# EasyEDA Pro project 四合一.epro, schematic Schematic2

## Sheets
1 1口驱动: Create Date: 2024-09-14; Page Name: 1口驱动; Project Name: CH32无刷电调; Schematic Name: Schematic2; Update Date: 2024-09-22; Company: 嘉立创EDA; Page Size: A4; Version: V1.0
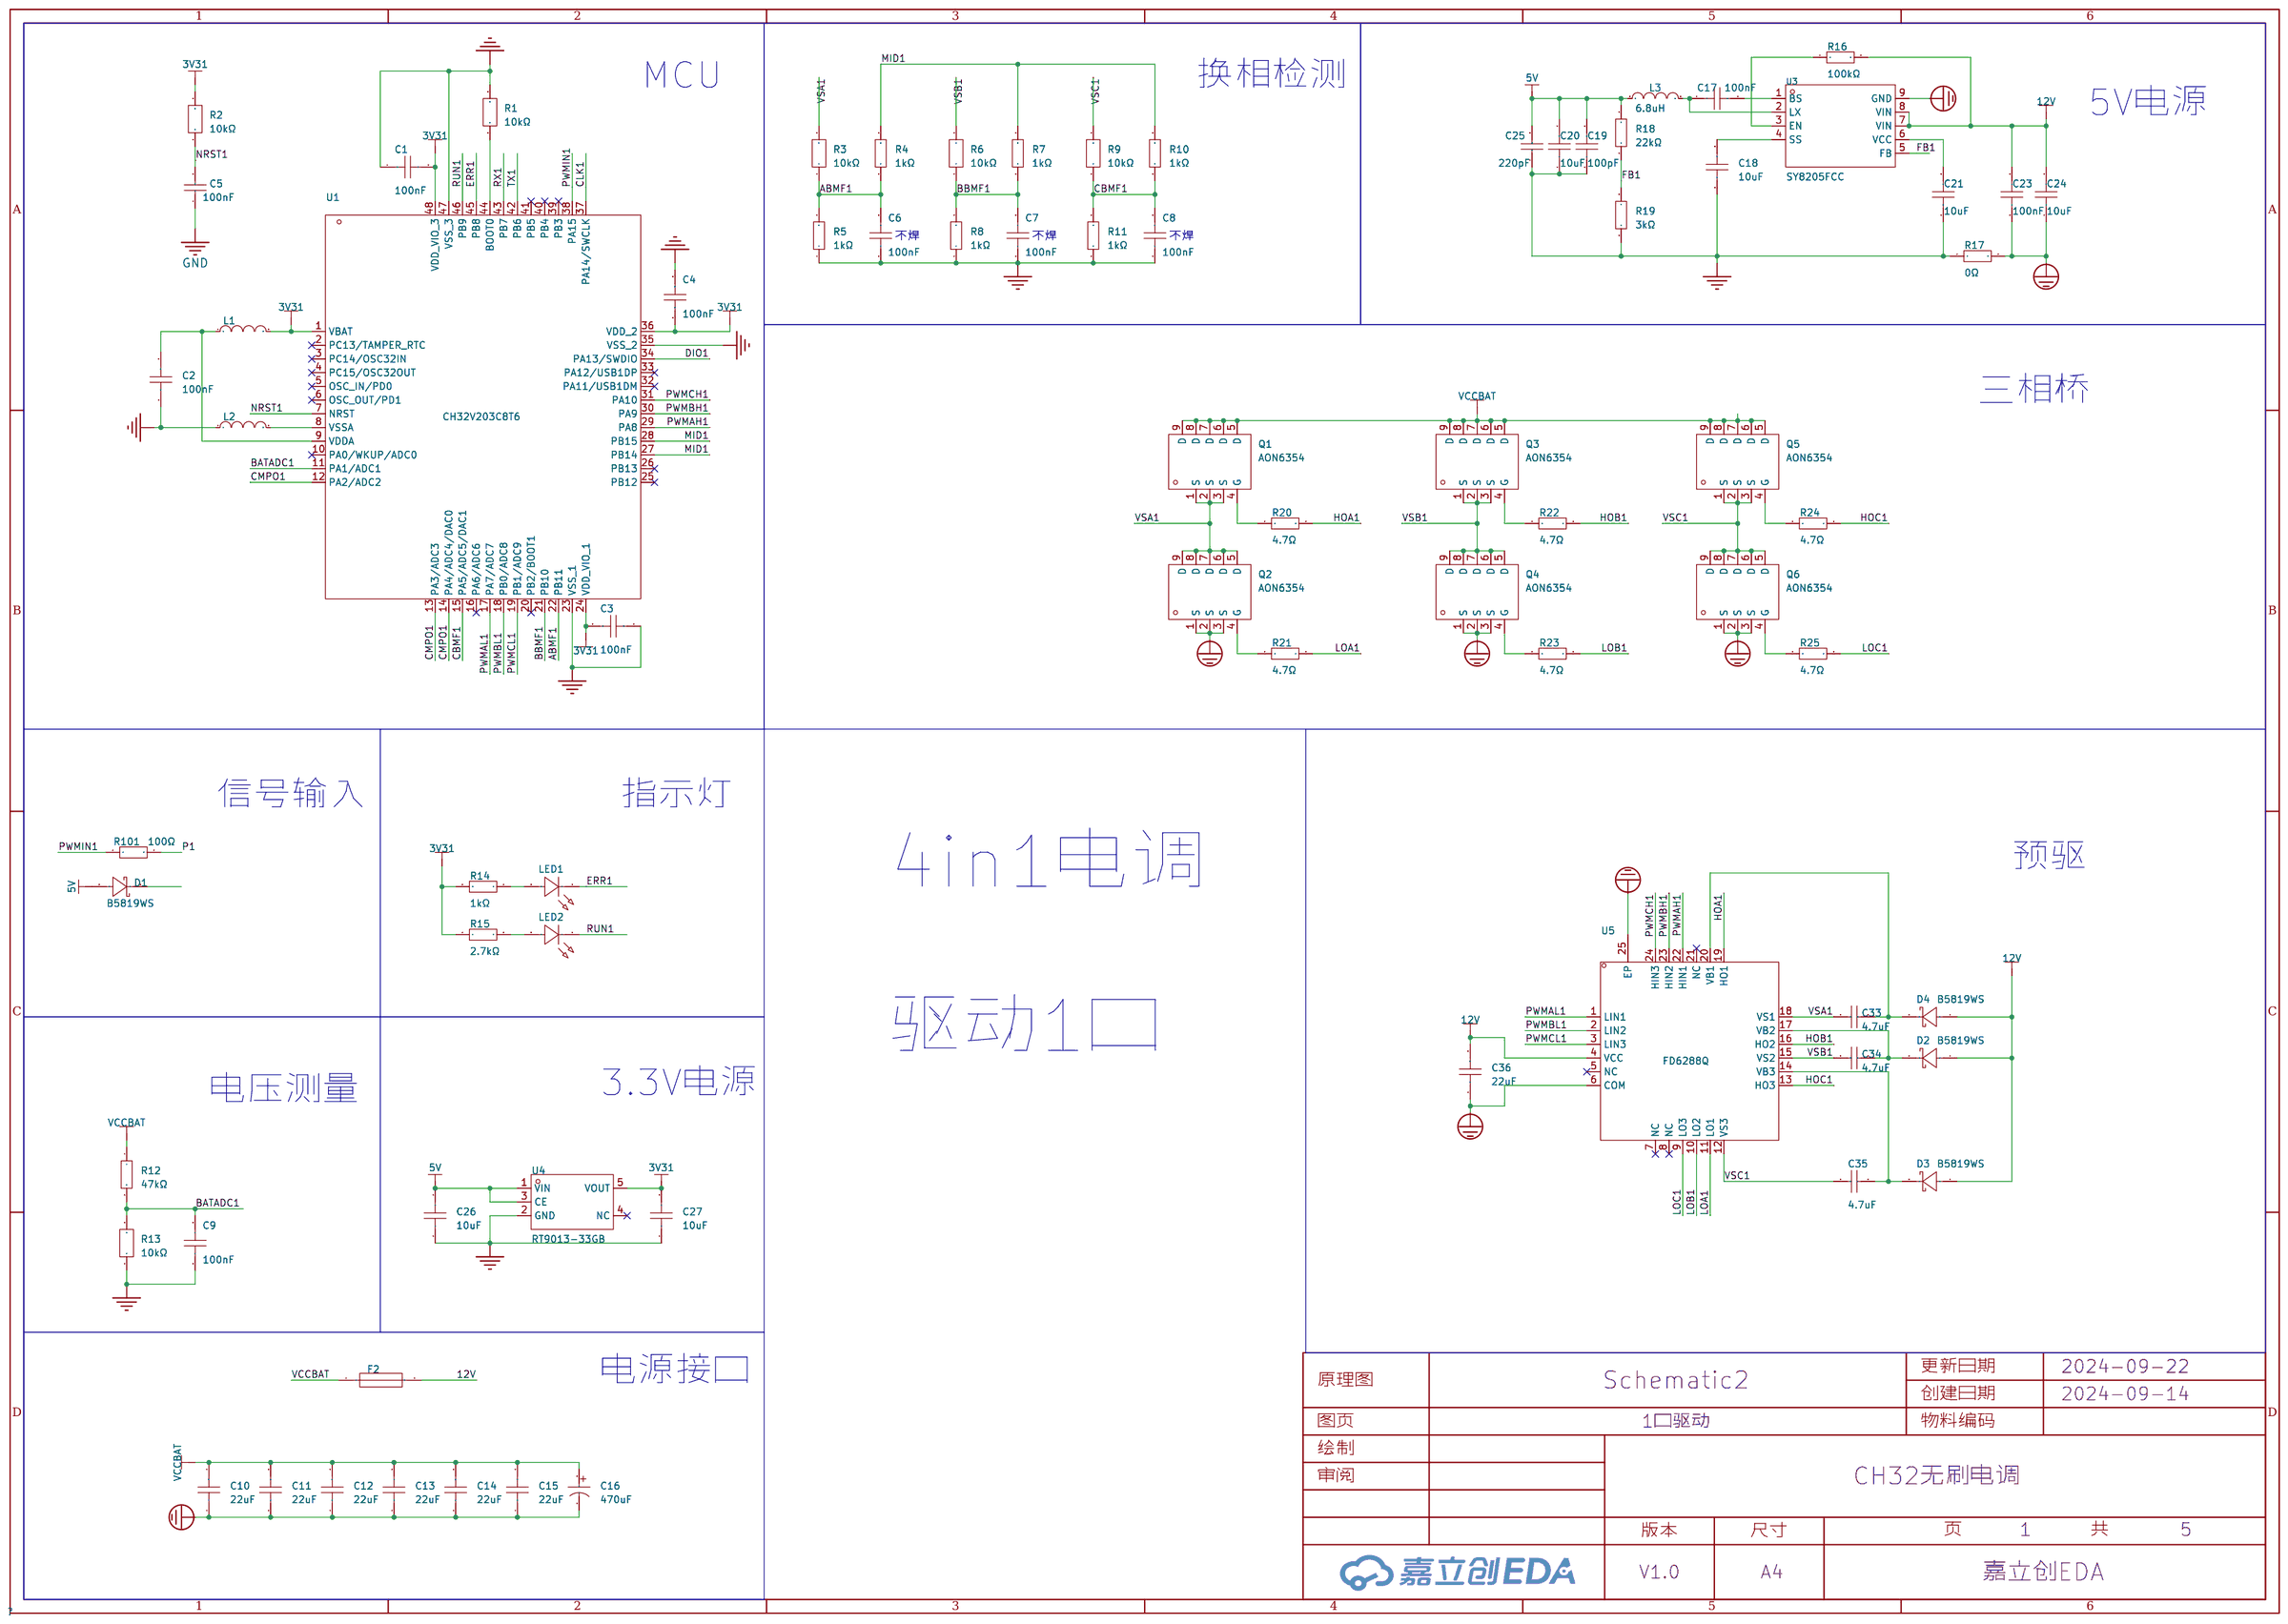
[diagram p0: 1口驱动]
2 2口驱动: Create Date: 2024-09-16; Page Name: 2口驱动
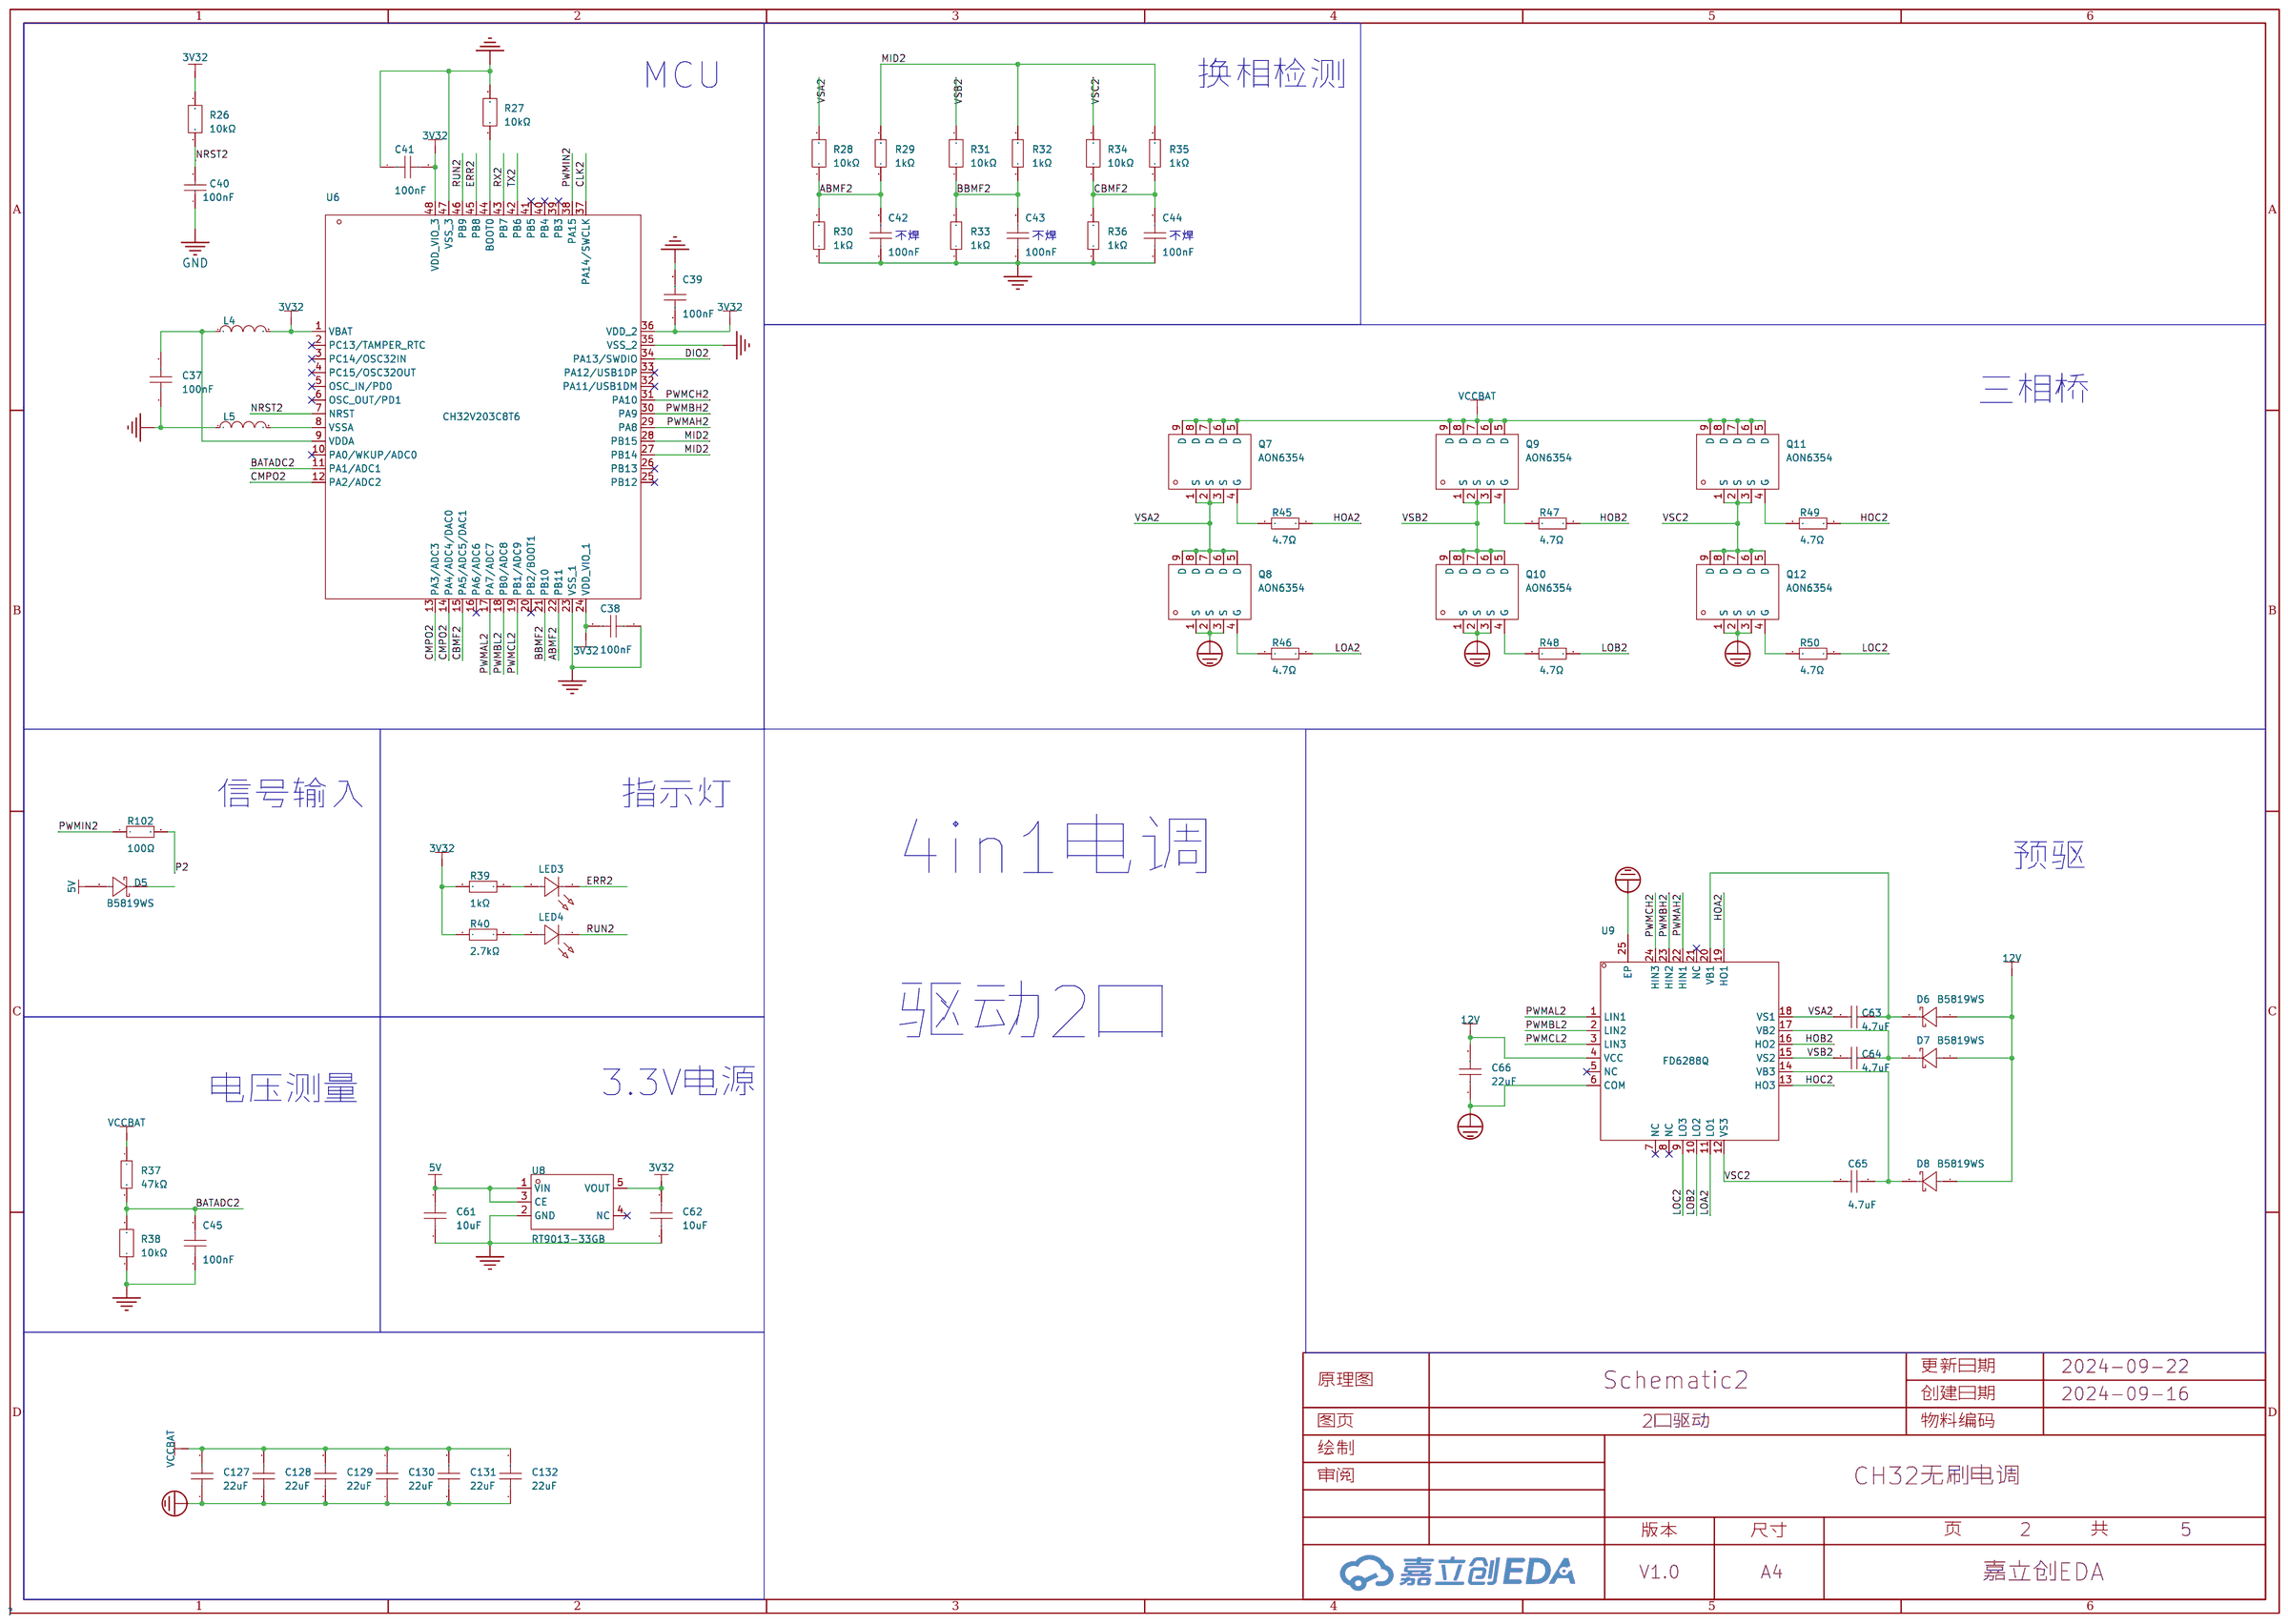
[diagram p1: 2口驱动]
3 3口驱动: Create Date: 2024-09-16; Page Name: 3口驱动
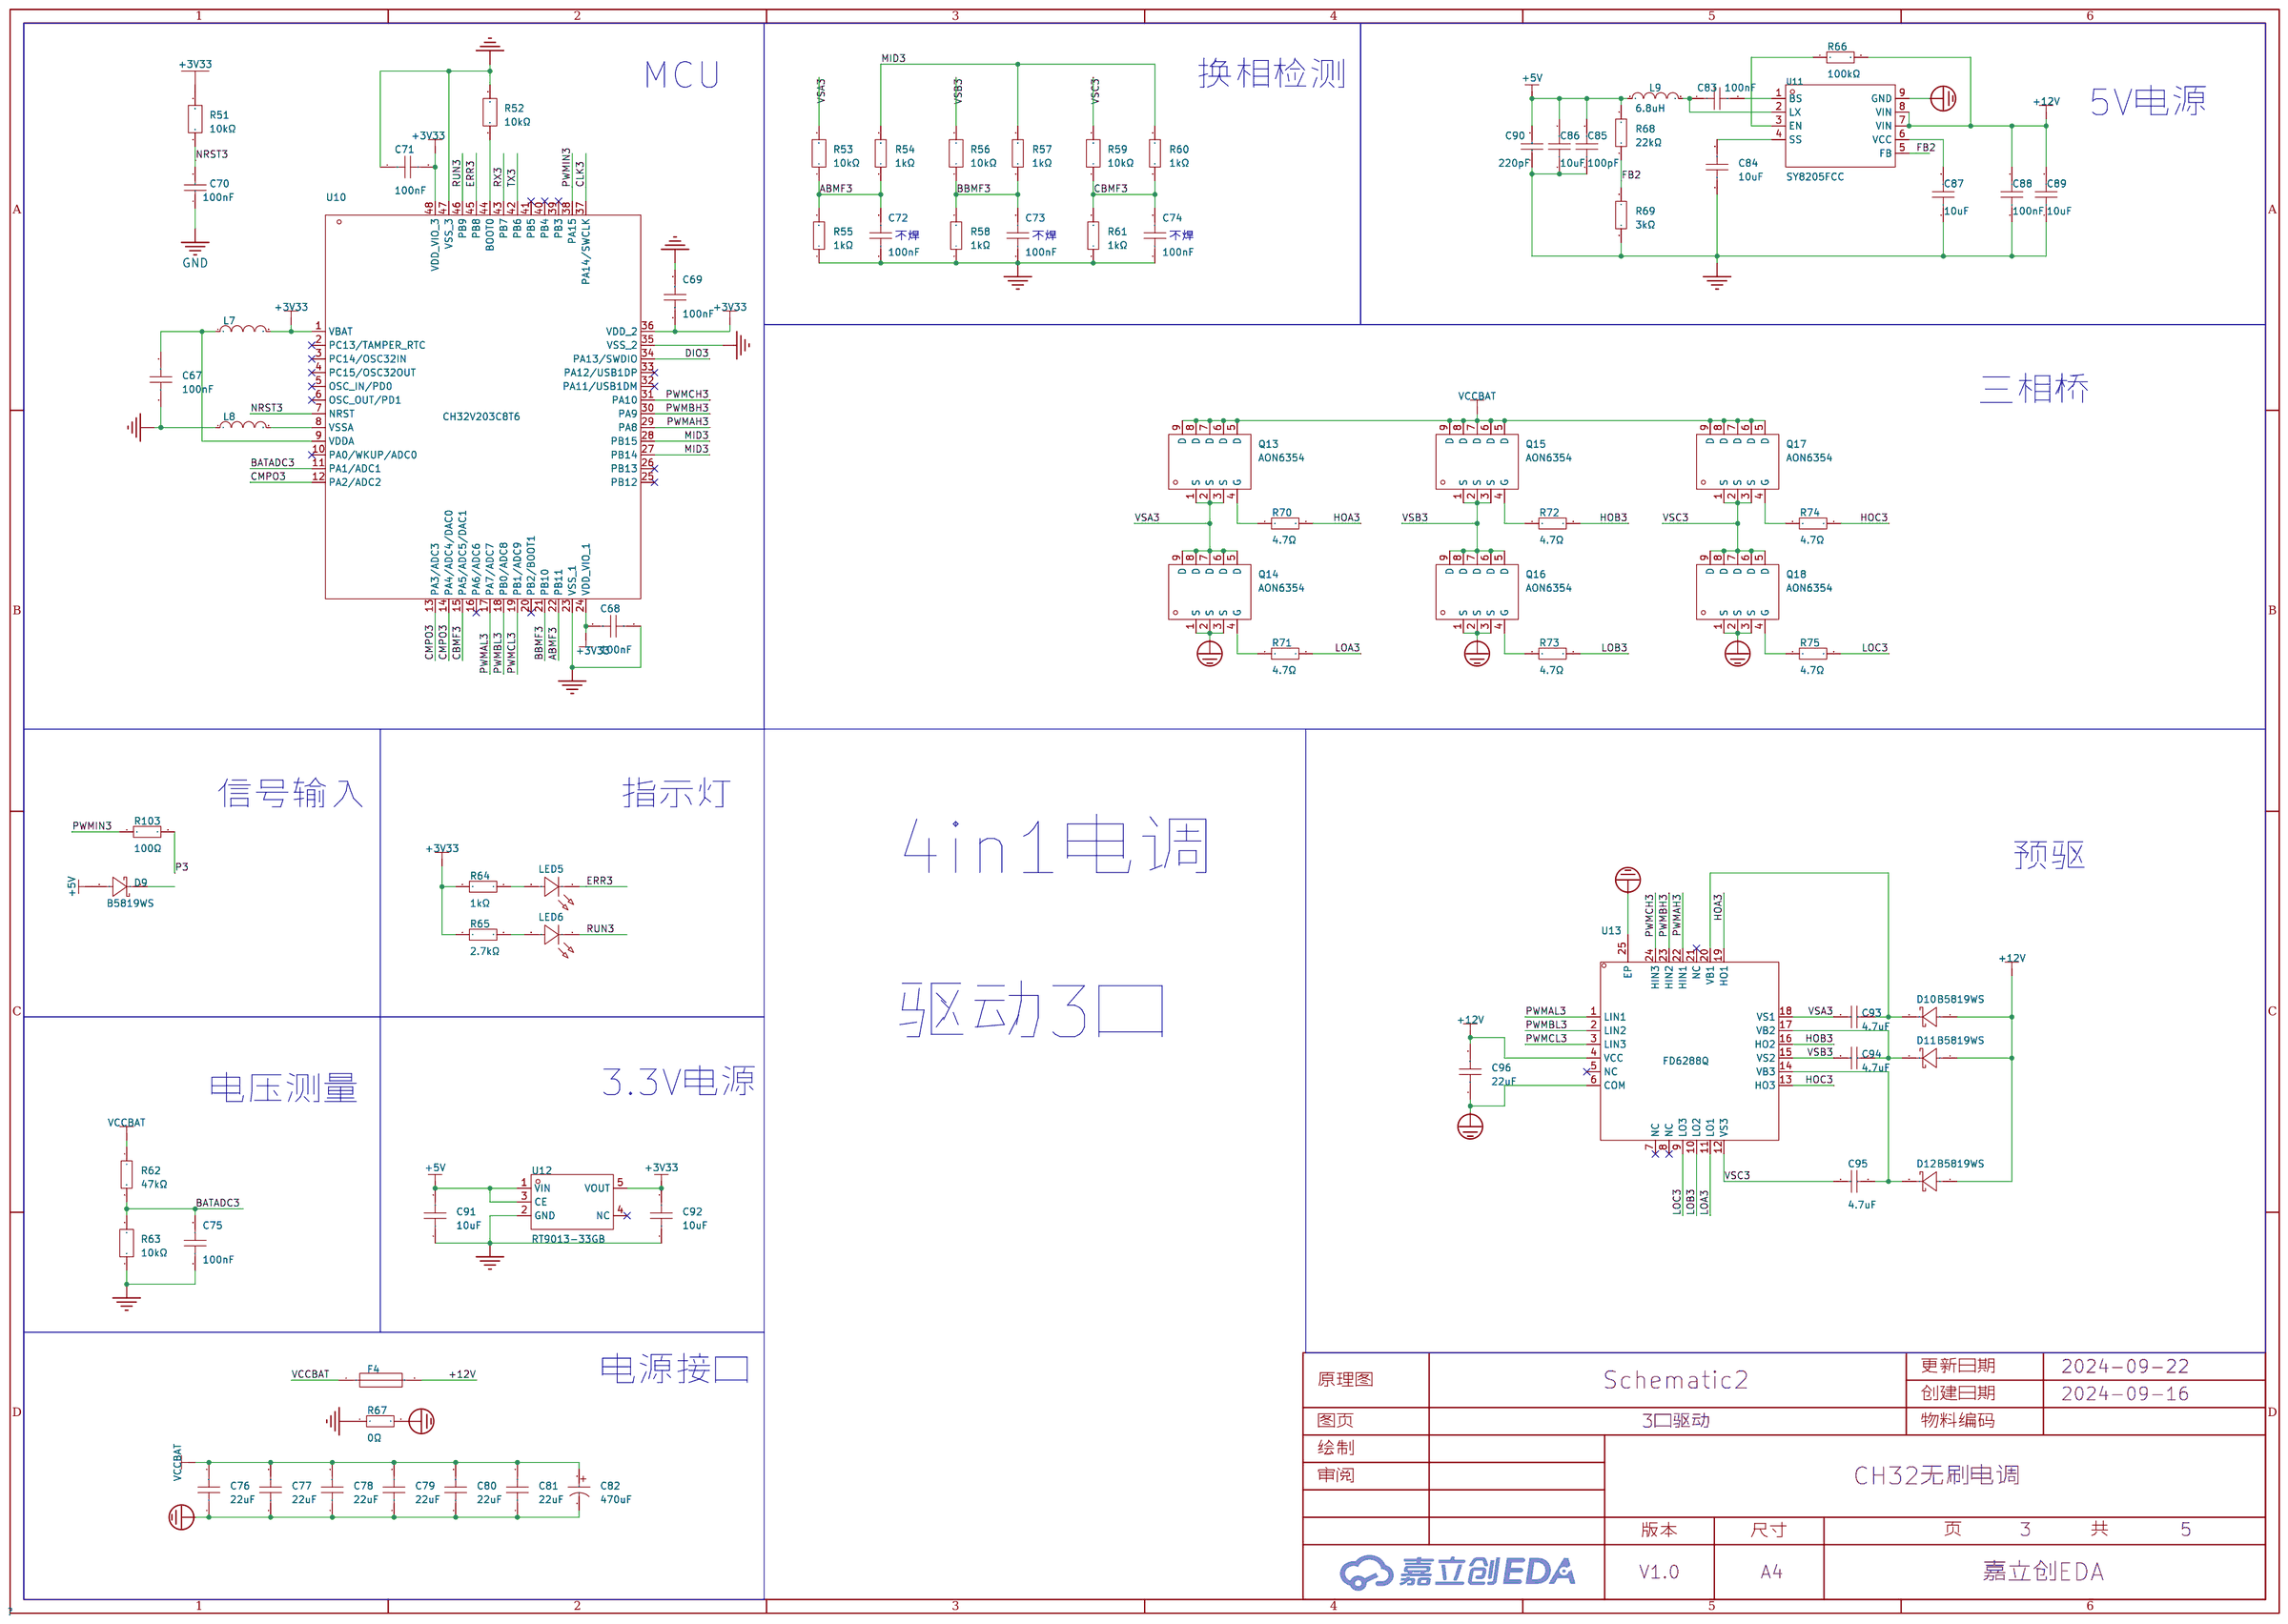
[diagram p2: 3口驱动]
4 4口驱动: Create Date: 2024-09-16; Page Name: 4口驱动; Update Date: 2024-09-19
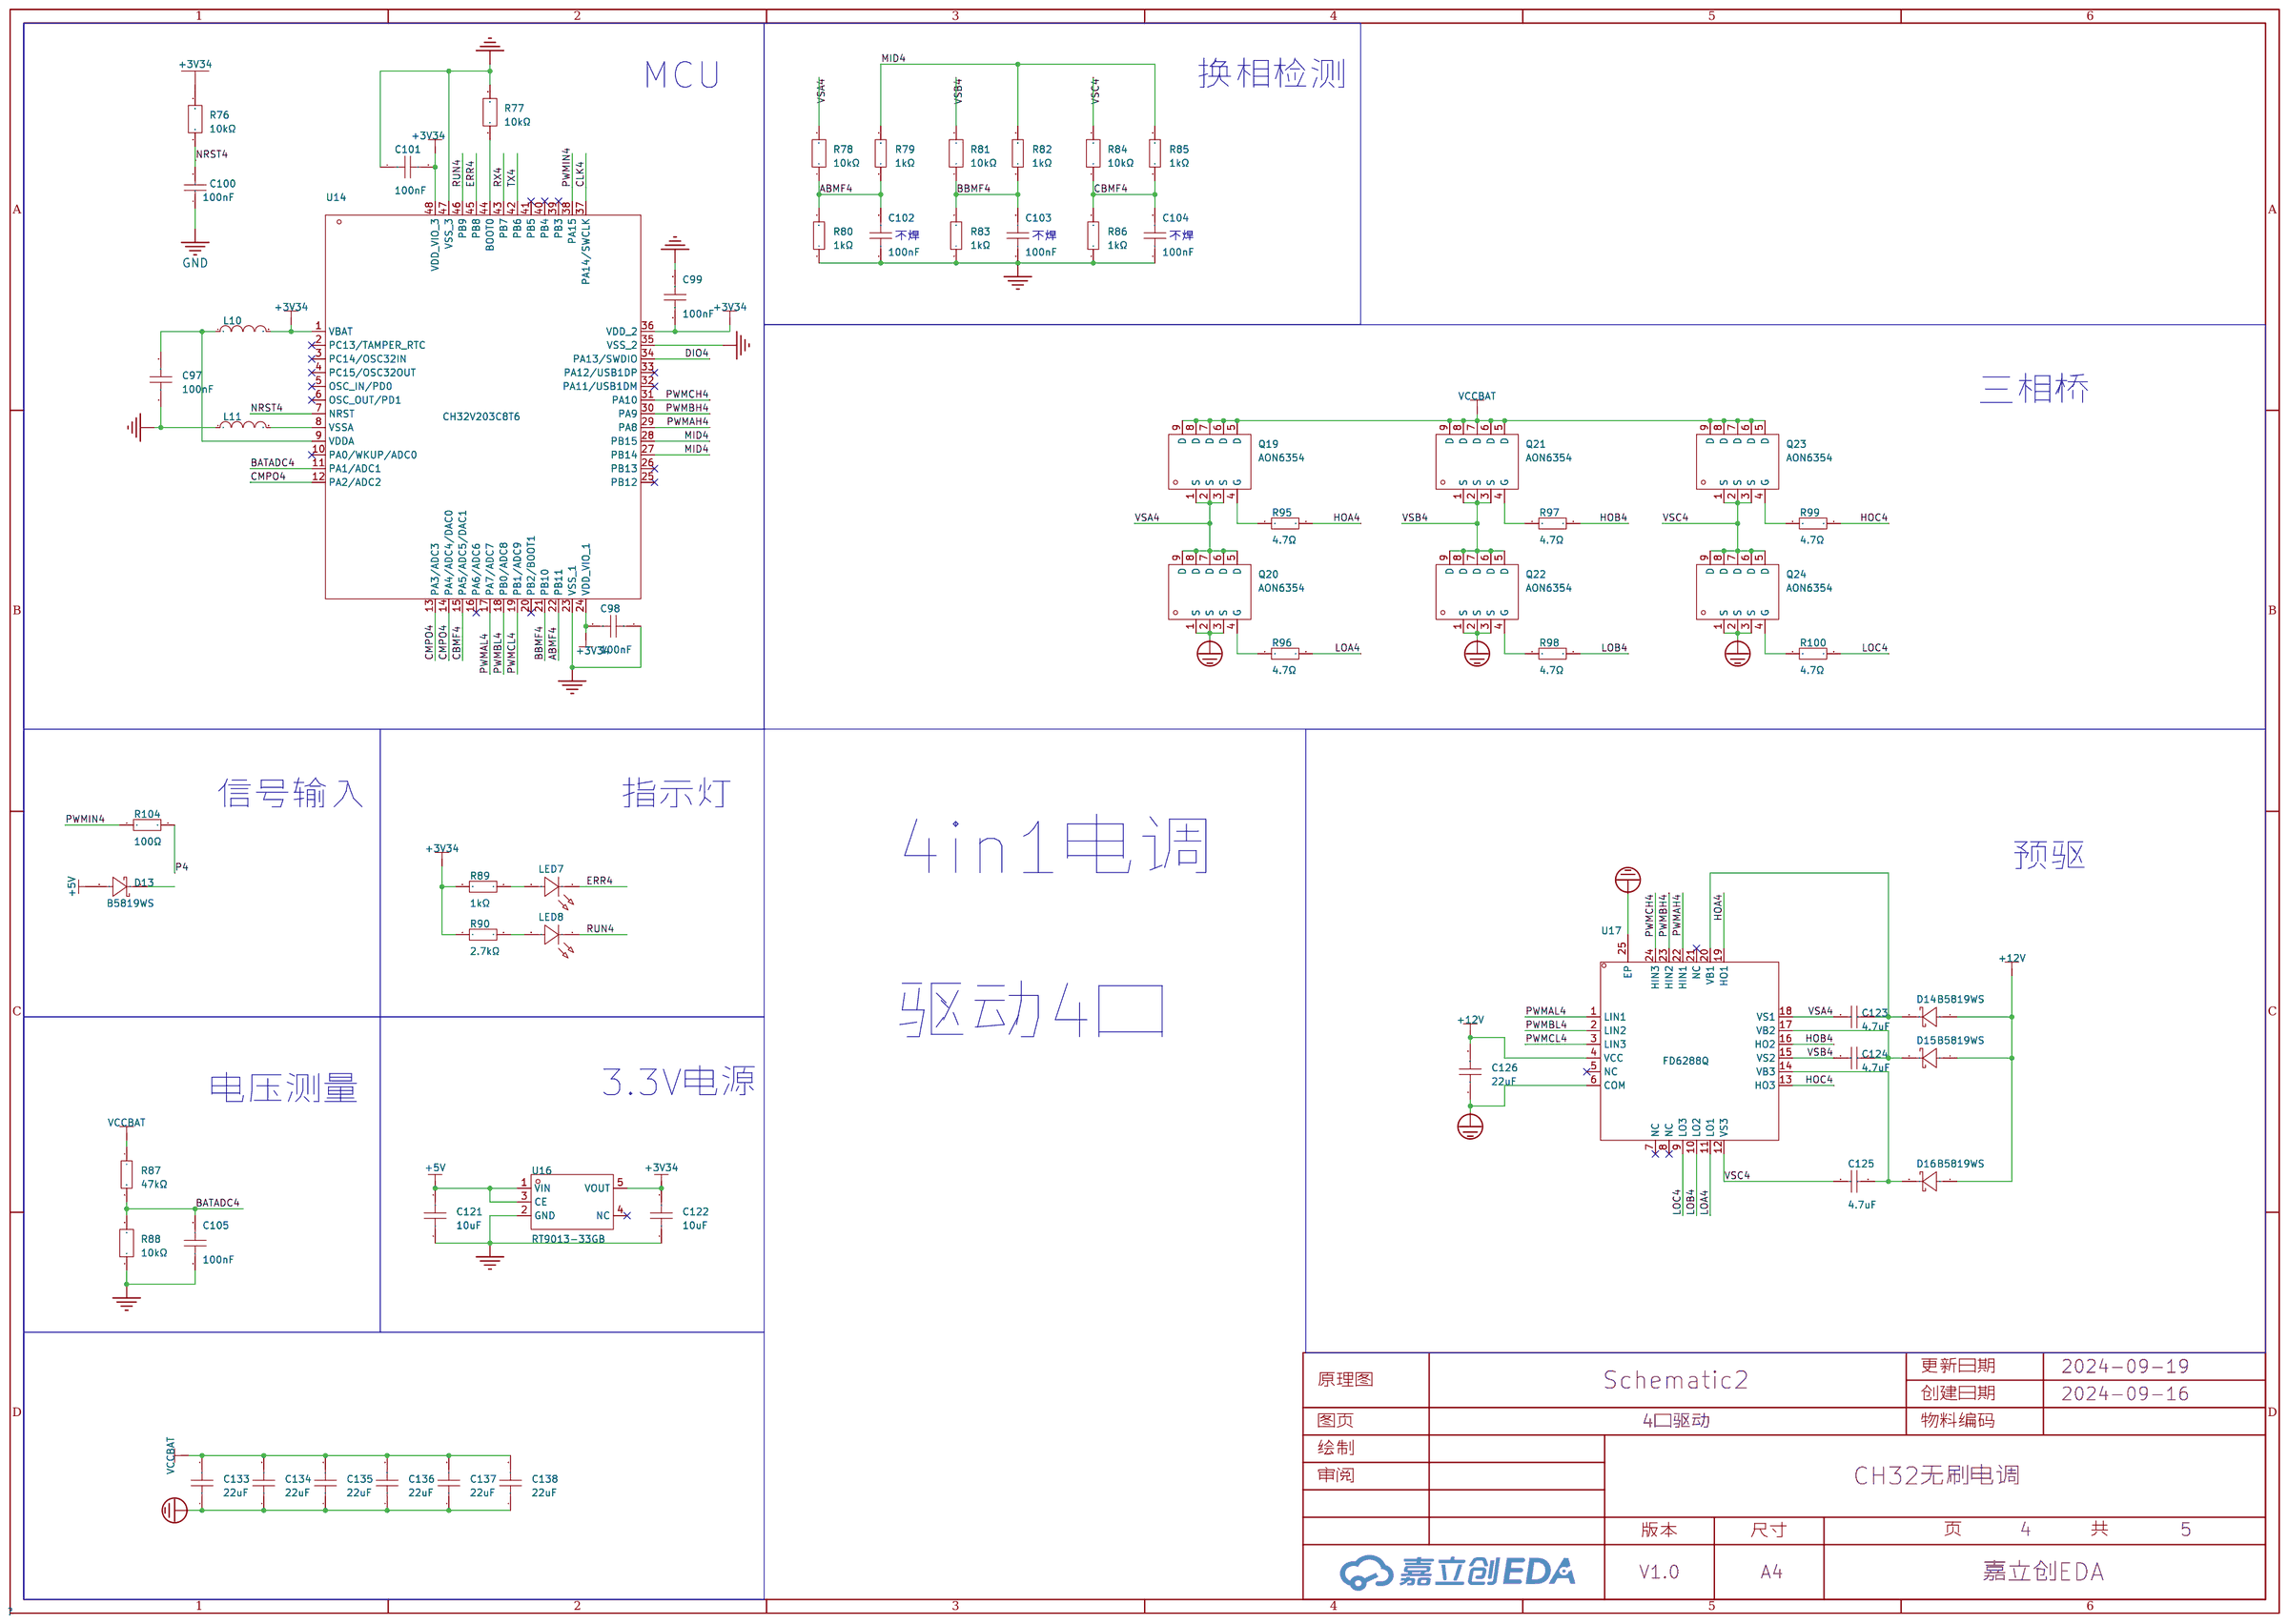
[diagram p3: 4口驱动]
5 外部接口: Create Date: 2024-09-16; Page Name: 外部接口; Update Date: 2024-09-26
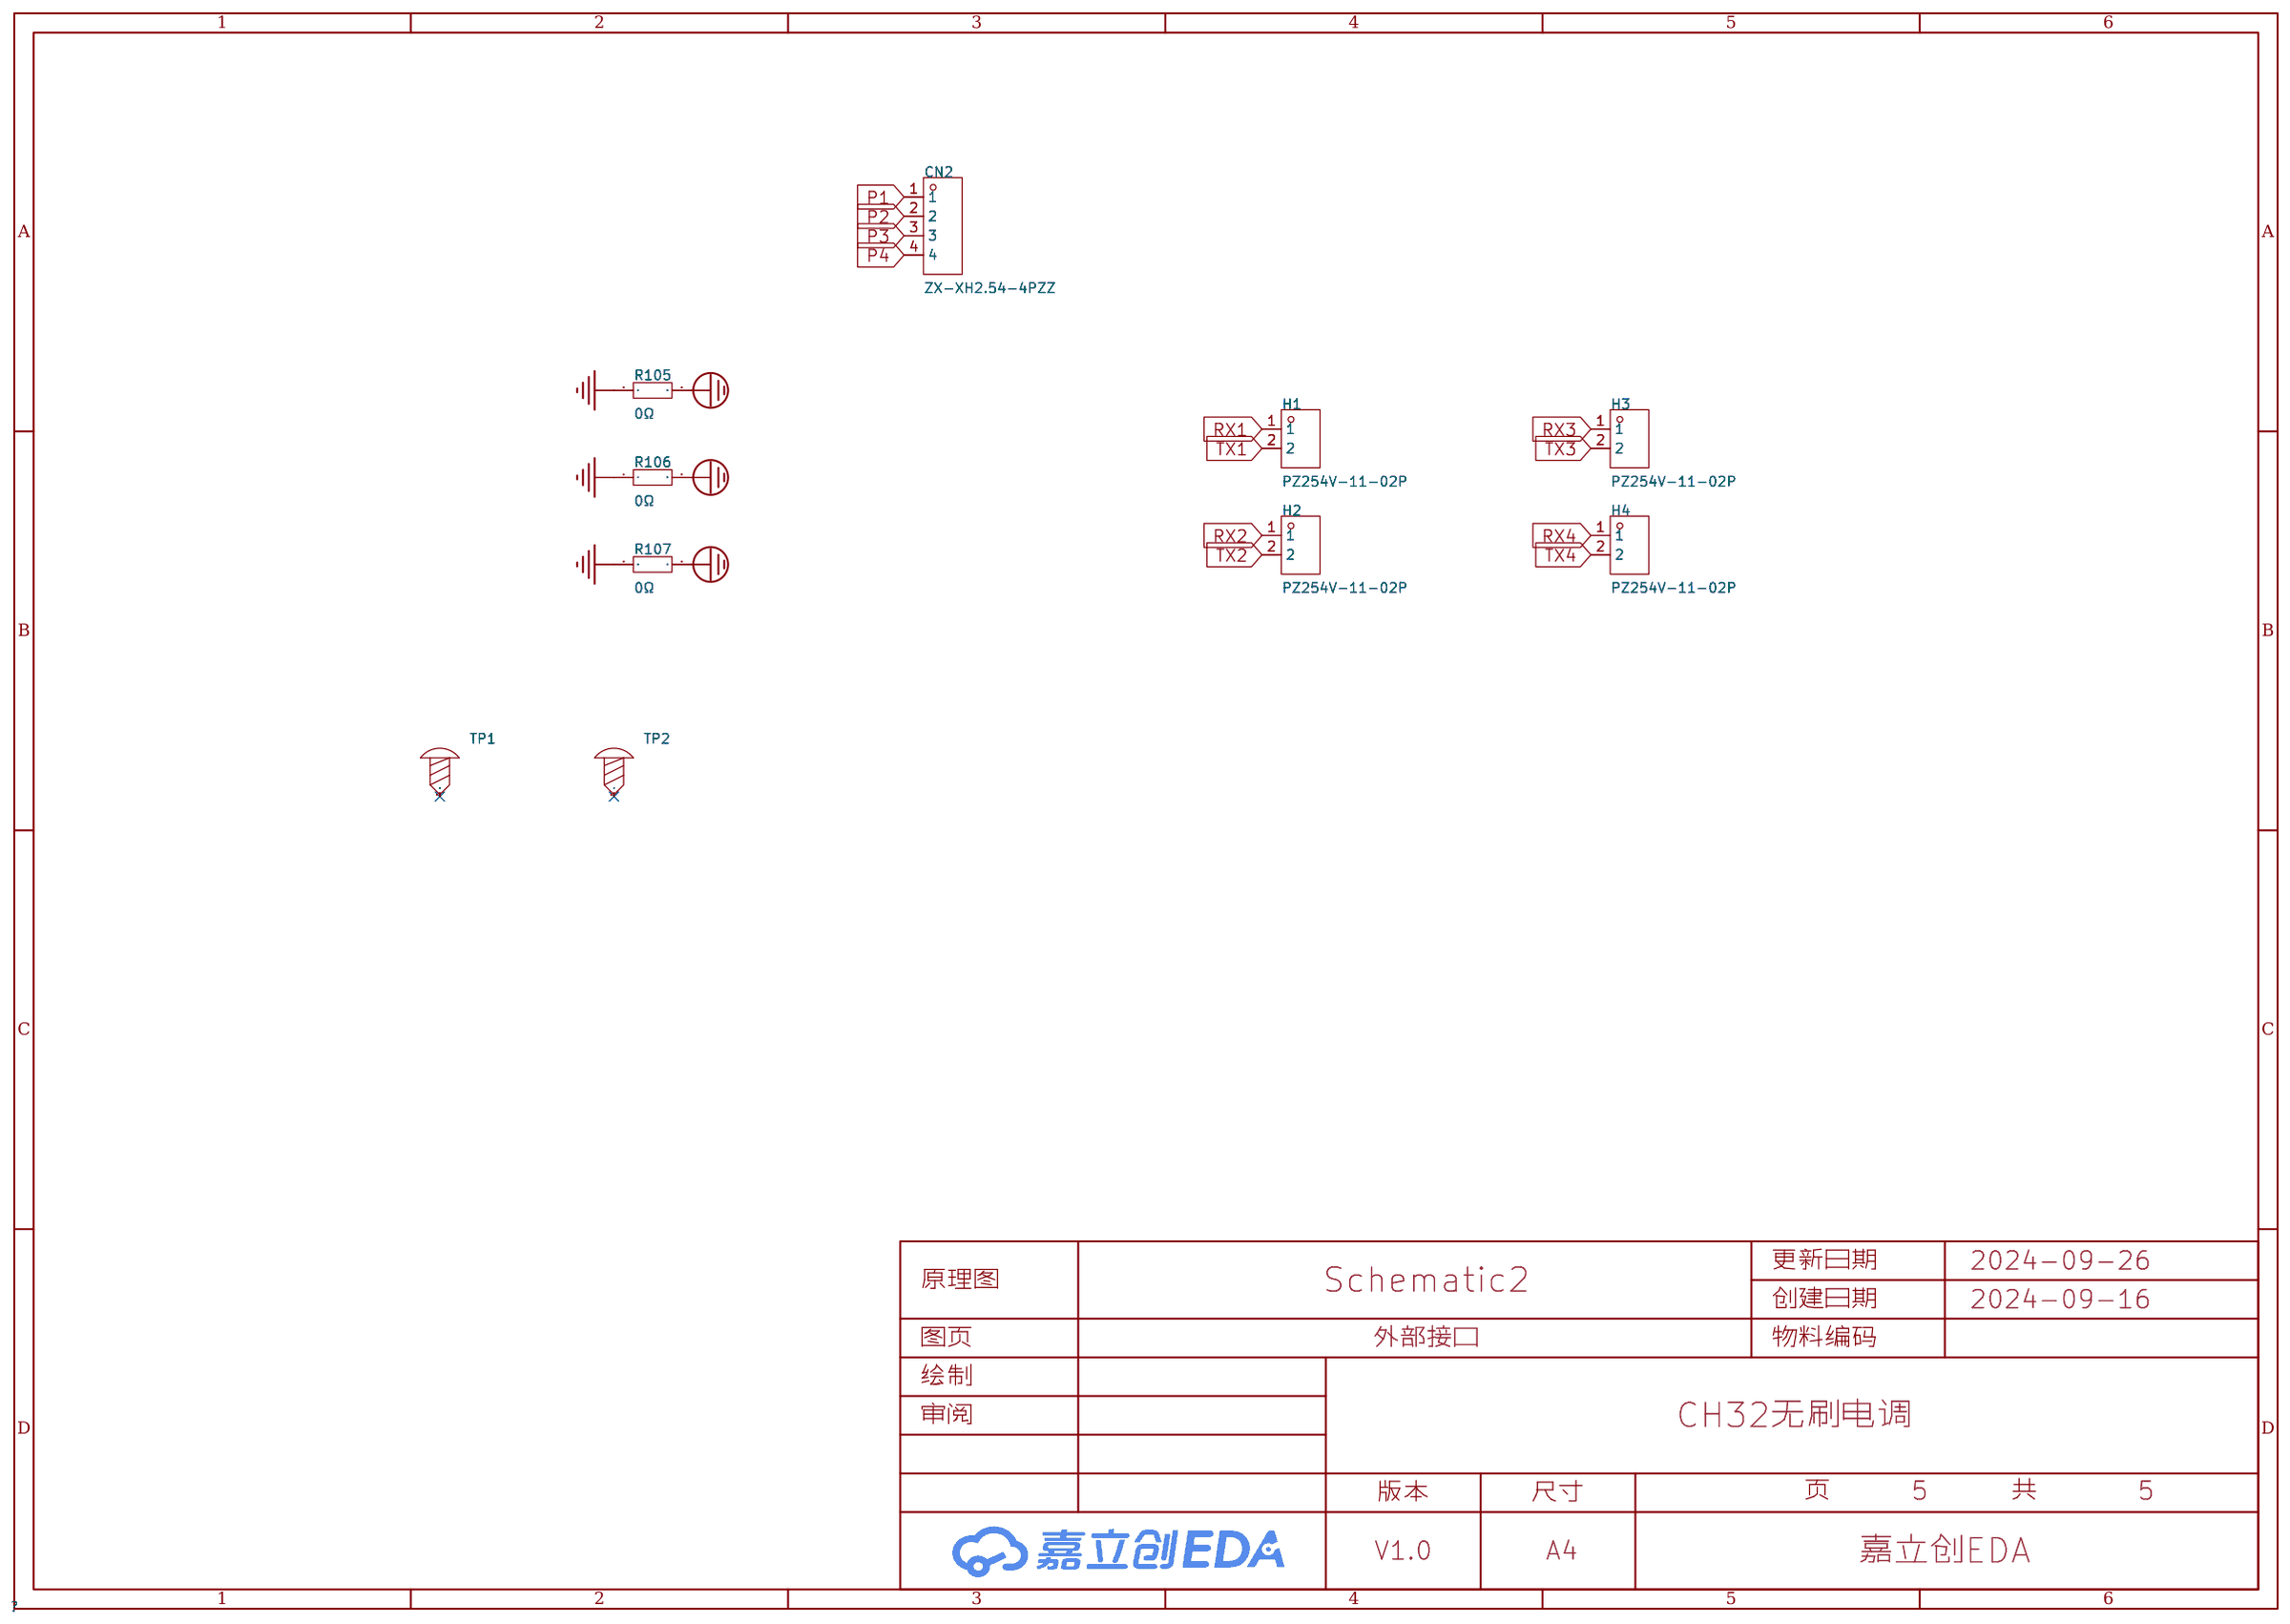
[diagram p4: 外部接口]

## Parts
sheet 1口驱动
C1  100nF  [C0603]
C2  100nF  [C0603]
C3  100nF  [C0603]
C4  100nF  [C0603]
C5  100nF  [c0603]
C6  100nF  [C0603]
C7  100nF  [C0603]
C8  100nF  [C0603]
C9  100nF  [C0603]
C10  22uF  [C0805]
C11  22uF  [C0805]
C12  22uF  [C0805]
C13  22uF  [C0805]
C14  22uF  [C0805]
C15  22uF  [C0805]
C16  470uF  [CAP-TH_BD8.0-P3.50-D0.6-FD]
C17  100nF  [C0603]
C18  10uF  [C0805]
C19  100pF  [C0603]
C20  10uF  [C0603]
C21  10uF  [C0603]
C23  100nF  [C0603]
C24  10uF  [C0805]
C25  220pF  [C0603]
C26  10uF  [C0603]
C27  10uF  [C0603]
C33  4.7uF  [C0603]
C34  4.7uF  [C0603]
C35  4.7uF  [C0603]
C36  22uF  [C0805]
D1  B5819WS  [SOD-323_L1.7-W1.3-LS2.5-FD]
D2  B5819WS  [SOD-323_L1.7-W1.3-LS2.5-FD]
D3  B5819WS  [SOD-323_L1.7-W1.3-LS2.5-FD]
D4  B5819WS  [SOD-323_L1.7-W1.3-LS2.5-FD]
F2  BSMD1206-150-16V  [F1206]
L1  CBG160808U000T  [L0603]
L2  CBG160808U000T  [L0603]
L3  6.8uH  [IND-SMD_L5.4-W5.2_FXL0530]
LED1  XL-1608UGC-04  [LED0603-RD_GREEN]
LED2  XL-1608UGC-04  [LED0603-RD_GREEN]
Q1  AON6354  [DFN-8_L5.2-W6.1-P1.27-BL-EP]
Q2  AON6354  [DFN-8_L5.2-W6.1-P1.27-BL-EP]
Q3  AON6354  [DFN-8_L5.2-W6.1-P1.27-BL-EP]
Q4  AON6354  [DFN-8_L5.2-W6.1-P1.27-BL-EP]
Q5  AON6354  [DFN-8_L5.2-W6.1-P1.27-BL-EP]
Q6  AON6354  [DFN-8_L5.2-W6.1-P1.27-BL-EP]
R1  10kΩ  [R0603]
R2  10kΩ  [R0603]
R3  10kΩ  [R0603]
R4  1kΩ  [R0603]
R5  1kΩ  [R0603]
R6  10kΩ  [R0603]
R7  1kΩ  [R0603]
R8  1kΩ  [R0603]
R9  10kΩ  [R0603]
R10  1kΩ  [R0603]
R11  1kΩ  [R0603]
R12  47kΩ  [R0603]
R13  10kΩ  [R0603]
R14  1kΩ  [R0603]
R15  2.7kΩ  [R0603]
R16  100kΩ  [R0603]
R17  0Ω  [R0603]
R18  22kΩ  [R0603]
R19  3kΩ  [R0603]
R20  4.7Ω  [R0603]
R21  4.7Ω  [R0603]
R22  4.7Ω  [R0603]
R23  4.7Ω  [R0603]
R24  4.7Ω  [R0603]
R25  4.7Ω  [R0603]
R101  100Ω  [R0603]
U1  CH32V203C8T6  [LQFP-48_L7.0-W7.0-P0.50-LS9.0-BL]
U3  SY8205FCC  [SOIC-8_L5.0-W4.0-P1.27-LS6.0-BL-EP2.0]
U4  RT9013-33GB  [SOT-23-5_L2.9-W1.6-P0.95-LS2.8-BR]
U5  FD6288Q  [QFN-24_L4.0-W4.0-P0.50-BL-EP2.6]
sheet 2口驱动
C37  100nF  [C0603]
C38  100nF  [C0603]
C39  100nF  [C0603]
C40  100nF  [c0603]
C41  100nF  [C0603]
C42  100nF  [C0603]
C43  100nF  [C0603]
C44  100nF  [C0603]
C45  100nF  [C0603]
C61  10uF  [C0603]
C62  10uF  [C0603]
C63  4.7uF  [C0603]
C64  4.7uF  [C0603]
C65  4.7uF  [C0603]
C66  22uF  [C0805]
C127  22uF  [C0805]
C128  22uF  [C0805]
C129  22uF  [C0805]
C130  22uF  [C0805]
C131  22uF  [C0805]
C132  22uF  [C0805]
D5  B5819WS  [SOD-323_L1.7-W1.3-LS2.5-FD]
D6  B5819WS  [SOD-323_L1.7-W1.3-LS2.5-FD]
D7  B5819WS  [SOD-323_L1.7-W1.3-LS2.5-FD]
D8  B5819WS  [SOD-323_L1.7-W1.3-LS2.5-FD]
L4  CBG160808U000T  [L0603]
L5  CBG160808U000T  [L0603]
LED3  XL-1608UGC-04  [LED0603-RD_GREEN]
LED4  XL-1608UGC-04  [LED0603-RD_GREEN]
Q7  AON6354  [DFN-8_L5.2-W6.1-P1.27-BL-EP]
Q8  AON6354  [DFN-8_L5.2-W6.1-P1.27-BL-EP]
Q9  AON6354  [DFN-8_L5.2-W6.1-P1.27-BL-EP]
Q10  AON6354  [DFN-8_L5.2-W6.1-P1.27-BL-EP]
Q11  AON6354  [DFN-8_L5.2-W6.1-P1.27-BL-EP]
Q12  AON6354  [DFN-8_L5.2-W6.1-P1.27-BL-EP]
R26  10kΩ  [R0603]
R27  10kΩ  [R0603]
R28  10kΩ  [R0603]
R29  1kΩ  [R0603]
R30  1kΩ  [R0603]
R31  10kΩ  [R0603]
R32  1kΩ  [R0603]
R33  1kΩ  [R0603]
R34  10kΩ  [R0603]
R35  1kΩ  [R0603]
R36  1kΩ  [R0603]
R37  47kΩ  [R0603]
R38  10kΩ  [R0603]
R39  1kΩ  [R0603]
R40  2.7kΩ  [R0603]
R45  4.7Ω  [R0603]
R46  4.7Ω  [R0603]
R47  4.7Ω  [R0603]
R48  4.7Ω  [R0603]
R49  4.7Ω  [R0603]
R50  4.7Ω  [R0603]
R102  100Ω  [R0603]
U6  CH32V203C8T6  [LQFP-48_L7.0-W7.0-P0.50-LS9.0-BL]
U8  RT9013-33GB  [SOT-23-5_L2.9-W1.6-P0.95-LS2.8-BR]
U9  FD6288Q  [QFN-24_L4.0-W4.0-P0.50-BL-EP2.6]
sheet 3口驱动
C67  100nF  [C0603]
C68  100nF  [C0603]
C69  100nF  [C0603]
C70  100nF  [c0603]
C71  100nF  [C0603]
C72  100nF  [C0603]
C73  100nF  [C0603]
C74  100nF  [C0603]
C75  100nF  [C0603]
C76  22uF  [C0805]
C77  22uF  [C0805]
C78  22uF  [C0805]
C79  22uF  [C0805]
C80  22uF  [C0805]
C81  22uF  [C0805]
C82  470uF  [CAP-TH_BD8.0-P3.50-D0.6-FD]
C83  100nF  [C0603]
C84  10uF  [C0805]
C85  100pF  [C0603]
C86  10uF  [C0603]
C87  10uF  [C0603]
C88  100nF  [C0603]
C89  10uF  [C0805]
C90  220pF  [C0603]
C91  10uF  [C0603]
C92  10uF  [C0603]
C93  4.7uF  [C0603]
C94  4.7uF  [C0603]
C95  4.7uF  [C0603]
C96  22uF  [C0805]
D9  B5819WS  [SOD-323_L1.7-W1.3-LS2.5-FD]
D10  B5819WS  [SOD-323_L1.7-W1.3-LS2.5-FD]
D11  B5819WS  [SOD-323_L1.7-W1.3-LS2.5-FD]
D12  B5819WS  [SOD-323_L1.7-W1.3-LS2.5-FD]
F4  BSMD1206-150-16V  [F1206]
L7  CBG160808U000T  [L0603]
L8  CBG160808U000T  [L0603]
L9  6.8uH  [IND-SMD_L5.4-W5.2_FXL0530]
LED5  XL-1608UGC-04  [LED0603-RD_GREEN]
LED6  XL-1608UGC-04  [LED0603-RD_GREEN]
Q13  AON6354  [DFN-8_L5.2-W6.1-P1.27-BL-EP]
Q14  AON6354  [DFN-8_L5.2-W6.1-P1.27-BL-EP]
Q15  AON6354  [DFN-8_L5.2-W6.1-P1.27-BL-EP]
Q16  AON6354  [DFN-8_L5.2-W6.1-P1.27-BL-EP]
Q17  AON6354  [DFN-8_L5.2-W6.1-P1.27-BL-EP]
Q18  AON6354  [DFN-8_L5.2-W6.1-P1.27-BL-EP]
R51  10kΩ  [R0603]
R52  10kΩ  [R0603]
R53  10kΩ  [R0603]
R54  1kΩ  [R0603]
R55  1kΩ  [R0603]
R56  10kΩ  [R0603]
R57  1kΩ  [R0603]
R58  1kΩ  [R0603]
R59  10kΩ  [R0603]
R60  1kΩ  [R0603]
R61  1kΩ  [R0603]
R62  47kΩ  [R0603]
R63  10kΩ  [R0603]
R64  1kΩ  [R0603]
R65  2.7kΩ  [R0603]
R66  100kΩ  [R0603]
R67  0Ω  [R0603]
R68  22kΩ  [R0603]
R69  3kΩ  [R0603]
R70  4.7Ω  [R0603]
R71  4.7Ω  [R0603]
R72  4.7Ω  [R0603]
R73  4.7Ω  [R0603]
R74  4.7Ω  [R0603]
R75  4.7Ω  [R0603]
R103  100Ω  [R0603]
U10  CH32V203C8T6  [LQFP-48_L7.0-W7.0-P0.50-LS9.0-BL]
U11  SY8205FCC  [SOIC-8_L5.0-W4.0-P1.27-LS6.0-BL-EP2.0]
U12  RT9013-33GB  [SOT-23-5_L2.9-W1.6-P0.95-LS2.8-BR]
U13  FD6288Q  [QFN-24_L4.0-W4.0-P0.50-BL-EP2.6]
sheet 4口驱动
C97  100nF  [C0603]
C98  100nF  [C0603]
C99  100nF  [C0603]
C100  100nF  [c0603]
C101  100nF  [C0603]
C102  100nF  [C0603]
C103  100nF  [C0603]
C104  100nF  [C0603]
C105  100nF  [C0603]
C121  10uF  [C0603]
C122  10uF  [C0603]
C123  4.7uF  [C0603]
C124  4.7uF  [C0603]
C125  4.7uF  [C0603]
C126  22uF  [C0805]
C133  22uF  [C0805]
C134  22uF  [C0805]
C135  22uF  [C0805]
C136  22uF  [C0805]
C137  22uF  [C0805]
C138  22uF  [C0805]
D13  B5819WS  [SOD-323_L1.7-W1.3-LS2.5-FD]
D14  B5819WS  [SOD-323_L1.7-W1.3-LS2.5-FD]
D15  B5819WS  [SOD-323_L1.7-W1.3-LS2.5-FD]
D16  B5819WS  [SOD-323_L1.7-W1.3-LS2.5-FD]
L10  CBG160808U000T  [L0603]
L11  CBG160808U000T  [L0603]
LED7  XL-1608UGC-04  [LED0603-RD_GREEN]
LED8  XL-1608UGC-04  [LED0603-RD_GREEN]
Q19  AON6354  [DFN-8_L5.2-W6.1-P1.27-BL-EP]
Q20  AON6354  [DFN-8_L5.2-W6.1-P1.27-BL-EP]
Q21  AON6354  [DFN-8_L5.2-W6.1-P1.27-BL-EP]
Q22  AON6354  [DFN-8_L5.2-W6.1-P1.27-BL-EP]
Q23  AON6354  [DFN-8_L5.2-W6.1-P1.27-BL-EP]
Q24  AON6354  [DFN-8_L5.2-W6.1-P1.27-BL-EP]
R76  10kΩ  [R0603]
R77  10kΩ  [R0603]
R78  10kΩ  [R0603]
R79  1kΩ  [R0603]
R80  1kΩ  [R0603]
R81  10kΩ  [R0603]
R82  1kΩ  [R0603]
R83  1kΩ  [R0603]
R84  10kΩ  [R0603]
R85  1kΩ  [R0603]
R86  1kΩ  [R0603]
R87  47kΩ  [R0603]
R88  10kΩ  [R0603]
R89  1kΩ  [R0603]
R90  2.7kΩ  [R0603]
R95  4.7Ω  [R0603]
R96  4.7Ω  [R0603]
R97  4.7Ω  [R0603]
R98  4.7Ω  [R0603]
R99  4.7Ω  [R0603]
R100  4.7Ω  [R0603]
R104  100Ω  [R0603]
U14  CH32V203C8T6  [LQFP-48_L7.0-W7.0-P0.50-LS9.0-BL]
U16  RT9013-33GB  [SOT-23-5_L2.9-W1.6-P0.95-LS2.8-BR]
U17  FD6288Q  [QFN-24_L4.0-W4.0-P0.50-BL-EP2.6]
sheet 外部接口
CN2  ZX-XH2.54-4PZZ  [CONN-TH_4P-P2.50_4PIN]
H1  PZ254V-11-02P  [HDR-TH_2P-P2.54-V-M]
H2  PZ254V-11-02P  [HDR-TH_2P-P2.54-V-M]
H3  PZ254V-11-02P  [HDR-TH_2P-P2.54-V-M]
H4  PZ254V-11-02P  [HDR-TH_2P-P2.54-V-M]
R105  0Ω  [R0603]
R106  0Ω  [R0603]
R107  0Ω  [R0603]
TP1  -  [M3螺丝]
TP2  -  [M3螺丝]

## Library data of the parts
C1-C4 C6-C9 C17 C23 C37-C39 C41-C45 C67-C69 C71-C75 C83 C88 C97-C99 C101-C105 = CGA0603X7R104K500JT: 容值:100nF;精度:±10%;额定电压:50V;材质(温度系数):X7R;; LCSC Part Name: 100nF ±10% 50V; Supplier Part: C6119867; Manufacturer: HRE(芯声); Supplier Footprint: 0603; JLCPCB Part Class: 扩展库; Supplier: LCSC; Tolerance: ±10%; Voltage Rated: 50V; Temperature Coefficient: X7R
C5 C40 C70 C100 = C 0402-100nF: 容值:100nF;精度:±10%;额定电压:50V;温度系数:X7R;; LCSC Part Name: 100nF ±10% 50V; Supplier Part: C307331; Manufacturer: SAMSUNG(三星); Manufacturer Part: CL05B104KB54PNC; Supplier Footprint: 0402; JLCPCB Part Class: Basic Part; Datasheet: https://atta.szlcsc.com/upload/public/pdf/source/20181009/C307331_222F7C870FD3EA5F46F538B483443886.pdf; Supplier: LCSC; Tolerance: ±10%; Voltage Rated: 50V; Temperature Coefficient: X7R
C10-C15 C76-C81 C127-C138 = CGA0805X5R226M350MT: 容值:22uF;精度:±20%;额定电压:35V;材质(温度系数):X5R;; LCSC Part Name: 22uF ±20% 35V; Supplier Part: C6119901; Manufacturer: HRE(芯声); Supplier Footprint: 0805; JLCPCB Part Class: 扩展库; Datasheet: https://atta.szlcsc.com/upload/public/pdf/source/20231129/D589D0CC4D260F7AC3A77E53B455CCB3.pdf; Supplier: LCSC; Tolerance: ±20%; Voltage Rated: 35V; Temperature Coefficient: X5R
C16 C82 = KM477M025F12RR0VH2FP0: 容值:470uF;精度:±20%;额定电压:25V;; LCSC Part Name: 470uF ±20% 25V; Supplier Part: C43839; Manufacturer: CX(承兴); Supplier Footprint: 插件,D8xL12mm; JLCPCB Part Class: 扩展库; Datasheet: https://atta.szlcsc.com/upload/public/pdf/source/20230915/80F12A3CAB98DAEEC2984174CA9E6511.pdf; Supplier: LCSC; Tolerance: ±20%; Rated Voltage: 25V; Lead Spacing: 3.5mm; φD: 8mm; L: 12mm; Lifetime @ Temp: 2000hrs@105℃
C18 C24 C84 C89 = CL21A106KBYQNNE: 容值:10uF;精度:±10%;额定电压:50V;材质(温度系数):X5R;; LCSC Part Name: 10uF ±10% 50V; Supplier Part: C2932476; Manufacturer: SAMSUNG(三星); Supplier Footprint: 0805; JLCPCB Part Class: 扩展库; Datasheet: https://atta.szlcsc.com/upload/public/pdf/source/20211217/EA547804C3DC63CB0E92325AB8B6CF61.pdf; Supplier: LCSC; Tolerance: ±10%; Voltage Rated: 50V; Temperature Coefficient: X5R
C19 C85 = CC0603JRNPO9BN101: 容值:100pF;精度:±5%;额定电压:50V;材质(温度系数):NP0;; LCSC Part Name: 100pF ±5% 50V; Supplier Part: C14665; Manufacturer: YAGEO(国巨); Supplier Footprint: 0603; JLCPCB Part Class: 扩展库; Datasheet: https://atta.szlcsc.com/upload/public/pdf/source/20181008/C309499_21CC21451B82C39E3D92150FD6B30293.pdf; Supplier: LCSC; Tolerance: ±5%; Voltage Rated: 50V; Temperature Coefficient: NP0
C20 C21 C86 C87 = CL10A106MA8NRNC: 容值:10uF;精度:±20%;额定电压:25V;材质(温度系数):X5R;; LCSC Part Name: 10uF ±20% 25V; Supplier Part: C96446; Manufacturer: SAMSUNG(三星); Supplier Footprint: 0603; JLCPCB Part Class: 基础库; Datasheet: https://atta.szlcsc.com/upload/public/pdf/source/20160218/1457707763339.pdf; Supplier: LCSC; Tolerance: ±20%; Voltage Rated: 25V; Temperature Coefficient: X5R
C25 C90 = CL10B221KB8NNNC: 容值:220pF;精度:±10%;额定电压:50V;材质(温度系数):X7R;; LCSC Part Name: 220pF ±10% 50V; Supplier Part: C1603; Manufacturer: SAMSUNG(三星); Supplier Footprint: 0603; JLCPCB Part Class: 基础库; Datasheet: https://atta.szlcsc.com/upload/public/pdf/source/20160218/1457707763339.pdf; Supplier: LCSC; Tolerance: ±10%; Voltage Rated: 50V; Temperature Coefficient: X7R
C26 C27 C61 C62 C91 C92 C121 C122 = CL10A106KP8NNNC: 容值:10uF;精度:±10%;额定电压:10V;材质(温度系数):X5R;; LCSC Part Name: 10uF ±10% 10V; Supplier Part: C19702; Manufacturer: SAMSUNG(三星); Supplier Footprint: 0603; JLCPCB Part Class: 基础库; Datasheet: https://atta.szlcsc.com/upload/public/pdf/source/20160218/1457707763339.pdf; Supplier: LCSC; Tolerance: ±10%; Voltage Rated: 10V; Temperature Coefficient: X5R
C33-C35 C63-C65 C93-C95 C123-C125 = CL10A475KO8NNNC: 容值:4.7uF;精度:±10%;额定电压:16V;材质(温度系数):X5R;; LCSC Part Name: 4.7uF ±10% 16V; Supplier Part: C19666; Manufacturer: SAMSUNG(三星); Supplier Footprint: 0603; JLCPCB Part Class: 基础库; Datasheet: https://atta.szlcsc.com/upload/public/pdf/source/20160218/1457707763339.pdf; Supplier: LCSC; Tolerance: ±10%; Voltage Rated: 16V; Temperature Coefficient: X5R
C36 C66 C96 C126 = CL21A226MAQNNNE: 容值:22uF;精度:±20%;额定电压:25V;材质(温度系数):X5R;; LCSC Part Name: 22uF ±20% 25V; Supplier Part: C45783; Manufacturer: SAMSUNG(三星); Supplier Footprint: 0805; JLCPCB Part Class: 基础库; Datasheet: https://atta.szlcsc.com/upload/public/pdf/source/20160218/1457707763339.pdf; Supplier: LCSC; Tolerance: ±20%; Voltage Rated: 25V; Temperature Coefficient: X5R
D1-D16 = B5819WS_C7420331: 二极管配置:独立式;正向压降(Vf):600mV@1.0A;直流反向耐压(Vr):40V;平均整流电流(Io):1A;; LCSC Part Name: 电压:40V 电流:1A; Supplier Part: C7420331; Manufacturer: 宏迦橙; Supplier Footprint: SOD-323; JLCPCB Part Class: 扩展库; Datasheet: https://atta.szlcsc.com/upload/public/pdf/source/20230828/03CA0F4F90DAE368A7153B7B5E4D0651.pdf; Supplier: LCSC; Diode Configuration: 独立式; Forward Voltage (Vf@If): 600mV@1.0A; Reverse Voltage (Vr): 40V; Average Rectified Current (Io): 1A; Reverse Leakage Current (Ir): 1mA@40V; Peak forward surge current: 10A
F2 F4 = BSMD1206-150-16V: 最大电压:16V;最大电流:40A;保持电流:1.5A;跳闸电流:3A;; LCSC Part Name: 16V 1.5A 1206自恢复; Supplier Part: C883133; Manufacturer: BHFUSE(佰宏); Supplier Footprint: 1206; JLCPCB Part Class: 扩展库; Datasheet: https://atta.szlcsc.com/upload/public/pdf/source/20230512/E419278EC8529AAF514173EF221BCF4B.pdf; Supplier: LCSC; Operating Voltage (Max): 16V; Current Rating (Max): 40A; Hold Current: 1.5A; Trip Current: 3A; Power Dissipation: 1W; Resistance - Initial (Ri) (Min): 25mΩ; Resistance - Post Trip (R1) (Max): 130mΩ; Maximum Time to Trip: 300ms; Operating Temperature: -40℃~+85℃
L1 L2 L4 L5 L7 L8 L10 L11 = CBG160808U000T: 标称阻抗@测试频率:0Ω@100MHz;直流电阻(RDC):100mΩ;; LCSC Part Name: 单路 0603磁珠 阻抗0Ω@100MHz; Supplier Part: C43163; Manufacturer: FH(风华); Supplier Footprint: 0603; JLCPCB Part Class: 扩展库; Datasheet: https://atta.szlcsc.com/upload/public/pdf/source/20190129/C361667_1614D407CC98D1D3CFBD9E1F7511C14D.pdf; Supplier: LCSC; Impedance @ Frequency: 0Ω@100MHz; DC Resistance: 100mΩ; Current Rating: 800mA; Circuits: 1
L3 L9 = FXL0530-6R8-M: 电感值:6.8uH;精度:±20%;额定电流:3.5A;饱和电流(Isat):4A;类型:一体成型电感;; LCSC Part Name: 6.8uH ±20% 4A; Supplier Part: C177249; Manufacturer: cjiang(长江微电); Supplier Footprint: SMD,5.2x5.4mm; JLCPCB Part Class: 扩展库; Datasheet: https://atta.szlcsc.com/upload/public/pdf/source/20240426/3189EA8206330E2108542F9E34E540E7.pdf; Supplier: LCSC; Tolerance: ±20%; Rated Current: 3.5A; Saturation Current (Isat): 4A; DC Resistance (DCR): 90mΩ; Type: 一体成型电感
LED1-LED8 = XL-1608UGC-04: 灯头类型:-;发光颜色:翠绿色;正向电压(VF):-;功率:80mW;正向电流:25mA;主波长:516nm~525nm;二极管配置:独立二极管;透镜颜色:无色透明透镜;色温:-;发光强度:-;发光角度:120°;载带方式:正贴;工作温度:-30℃~+85℃;; Supplier Part: C965804; Manufacturer: XINGLIGHT(成兴光); Supplier Footprint: 0603; JLCPCB Part Class: 扩展库; Datasheet: https://atta.szlcsc.com/upload/public/pdf/source/20221102/520D6E465E5CFD1609C8A4DBC80D4018.pdf; Supplier: LCSC; Emitted Color: 翠绿色; Power Dissipation: 80mW; Forward Current: 25mA; Dominant Wavelength: 516nm~525nm; Peak Wavelength: 534nm; Diode Configuration: 独立二极管; Lens Color: 无色透明透镜; Viewing Angle: 120°; Mounting Sytle: 正贴; Operating Temperature: -30℃~+85℃
Q1-Q24 = AON6354: 类型:1个N沟道;漏源电压(Vdss):30V;连续漏极电流(Id):83A;功率(Pd):36W;导通电阻(RDS(on)@Vgs,Id):3.3mΩ@10V,20A;阈值电压(Vgs(th)@Id):2.2V@250uA;; LCSC Part Name: 1个N沟道 耐压:30V 电流:83A; Supplier Part: C404363; Manufacturer: AOS; Supplier Footprint: DFN-8-EP(6.1x5.2); JLCPCB Part Class: 扩展库; Datasheet: https://atta.szlcsc.com/upload/public/pdf/source/20190722/C404363_B66680DC9BBA75AD55478C7E53E51982.pdf; Supplier: LCSC; Type: 1个N沟道; Drain Source Voltage (Vdss): 30V; Continuous Drain Current (Id): 83A; Power Dissipation (Pd): 36W; Drain Source On Resistance (RDS(on)@Vgs,Id): 3.3mΩ@10V,20A; Gate Threshold Voltage (Vgs(th)@Id): 2.2V@250uA
R1-R3 R6 R9 R13 R26-R28 R31 R34 R38 R51-R53 R56 R59 R63 R76-R78 R81 R84 R88 = FRC0603J103TS: 电阻类型:厚膜电阻;阻值:10kΩ;精度:±5%;功率:100mW;最大工作电压:75V;温度系数:±100ppm/℃;; LCSC Part Name: 10kΩ ±5% 100mW 厚膜电阻; Supplier Part: C2930027; Manufacturer: FOJAN(富捷); Supplier Footprint: 0603; JLCPCB Part Class: 扩展库; Datasheet: https://atta.szlcsc.com/upload/public/pdf/source/20211221/925EC7D7225764EE0046F22065062C87.pdf; Supplier: LCSC; Type: 厚膜电阻; Tolerance: ±5%; Power(Watts): 100mW; Overload Voltage (Max): 75V; Temperature Coefficient: ±100ppm/℃; Operating Temperature Range: -55℃~+155℃
R4 R5 R7 R8 R10 R11 R14 R29 R30 R32 R33 R35 R36 R39 R54 R55 R57 R58 R60 R61 R64 R79 R80 R82 R83 R85 R86 R89 = RC0603FR-071KL: 电阻类型:厚膜电阻;阻值:1kΩ;精度:±1%;功率:100mW;最大工作电压:75V;温度系数:±100ppm/℃;; LCSC Part Name: 厚膜电阻 1kΩ ±1% 100mW; Supplier Part: C22548; Manufacturer: YAGEO(国巨); Supplier Footprint: 0603; JLCPCB Part Class: 扩展库; Datasheet: https://atta.szlcsc.com/upload/public/pdf/source/20180316/70C0E2BDAE7FCC62C531A5A58D202EE1.pdf; Supplier: LCSC; Type: 厚膜电阻; Tolerance: ±1%; Power(Watts): 100mW; Overload Voltage (Max): 75V; Temperature Coefficient: ±100ppm/℃; Operating Temperature Range: -55℃~+155℃
R12 R37 R62 R87 = 0603WAF4702T5E: 电阻类型:厚膜电阻;阻值:47kΩ;精度:±1%;功率:100mW;最大工作电压:75V;温度系数:±100ppm/℃;; LCSC Part Name: 47kΩ ±1% 100mW 厚膜电阻; Supplier Part: C25819; Manufacturer: UNI-ROYAL(厚声); Supplier Footprint: 0603; JLCPCB Part Class: 基础库; Datasheet: https://atta.szlcsc.com/upload/public/pdf/source/20200306/C422600_1E6D84923E4A46A82E41ADD87F860B5C.pdf; Supplier: LCSC; Type: 厚膜电阻; Tolerance: ±1%; Power(Watts): 100mW; Overload Voltage (Max): 75V; Temperature Coefficient: ±100ppm/℃; Operating Temperature Range: -55℃~+155℃
R15 R40 R65 R90 = 0603WAF2701T5E: 电阻类型:厚膜电阻;阻值:2.7kΩ;精度:±1%;功率:100mW;最大工作电压:75V;温度系数:±100ppm/℃;; LCSC Part Name: 2.7kΩ ±1% 100mW 厚膜电阻; Supplier Part: C13167; Manufacturer: UNI-ROYAL(厚声); Supplier Footprint: 0603; JLCPCB Part Class: 基础库; Datasheet: https://atta.szlcsc.com/upload/public/pdf/source/20200306/C422600_1E6D84923E4A46A82E41ADD87F860B5C.pdf; Supplier: LCSC; Type: 厚膜电阻; Tolerance: ±1%; Power(Watts): 100mW; Overload Voltage (Max): 75V; Temperature Coefficient: ±100ppm/℃; Operating Temperature Range: -55℃~+155℃
R16 R66 = 0603WAF1003T5E: 电阻类型:厚膜电阻;阻值:100kΩ;精度:±1%;功率:100mW;最大工作电压:75V;温度系数:±100ppm/℃;; LCSC Part Name: 100kΩ ±1% 100mW 厚膜电阻; Supplier Part: C25803; Manufacturer: UNI-ROYAL(厚声); Supplier Footprint: 0603; JLCPCB Part Class: 基础库; Datasheet: https://atta.szlcsc.com/upload/public/pdf/source/20200306/C422600_1E6D84923E4A46A82E41ADD87F860B5C.pdf; Supplier: LCSC; Type: 厚膜电阻; Tolerance: ±1%; Power(Watts): 100mW; Overload Voltage (Max): 75V; Temperature Coefficient: ±100ppm/℃; Operating Temperature Range: -55℃~+155℃
R17 R67 R105-R107 = 0603WAF0000T5E: 电阻类型:厚膜电阻;阻值:0Ω;精度:±1%;功率:100mW;最大工作电压:75V;; LCSC Part Name: 0Ω ±1% 100mW 厚膜电阻; Supplier Part: C21189; Manufacturer: UNI-ROYAL(厚声); Supplier Footprint: 0603; JLCPCB Part Class: 基础库; Datasheet: https://atta.szlcsc.com/upload/public/pdf/source/20200306/C422600_1E6D84923E4A46A82E41ADD87F860B5C.pdf; Supplier: LCSC; Type: 厚膜电阻; Tolerance: ±1%; Power(Watts): 100mW; Overload Voltage (Max): 75V; Operating Temperature Range: -55℃~+155℃
R18 R68 = 0603WAF2202T5E: 电阻类型:厚膜电阻;阻值:22kΩ;精度:±1%;功率:100mW;最大工作电压:75V;温度系数:±100ppm/℃;; LCSC Part Name: 22kΩ ±1% 100mW 厚膜电阻; Supplier Part: C31850; Manufacturer: UNI-ROYAL(厚声); Supplier Footprint: 0603; JLCPCB Part Class: 基础库; Datasheet: https://atta.szlcsc.com/upload/public/pdf/source/20200306/C422600_1E6D84923E4A46A82E41ADD87F860B5C.pdf; Supplier: LCSC; Type: 厚膜电阻; Tolerance: ±1%; Power(Watts): 100mW; Overload Voltage (Max): 75V; Temperature Coefficient: ±100ppm/℃; Operating Temperature Range: -55℃~+155℃
R19 R69 = 0603WAF3001T5E: 电阻类型:厚膜电阻;阻值:3kΩ;精度:±1%;功率:100mW;最大工作电压:75V;温度系数:±100ppm/℃;; LCSC Part Name: 3kΩ ±1% 100mW 厚膜电阻; Supplier Part: C4211; Manufacturer: UNI-ROYAL(厚声); Supplier Footprint: 0603; JLCPCB Part Class: 基础库; Datasheet: https://atta.szlcsc.com/upload/public/pdf/source/20200306/C422600_1E6D84923E4A46A82E41ADD87F860B5C.pdf; Supplier: LCSC; Type: 厚膜电阻; Tolerance: ±1%; Power(Watts): 100mW; Overload Voltage (Max): 75V; Temperature Coefficient: ±100ppm/℃; Operating Temperature Range: -55℃~+155℃
R20-R25 R45-R50 R70-R75 R95-R100 = 0603WAF470KT5E: 电阻类型:厚膜电阻;阻值:4.7Ω;精度:±1%;功率:100mW;最大工作电压:75V;温度系数:±400ppm/℃;; LCSC Part Name: 4.7Ω ±1% 100mW 厚膜电阻; Supplier Part: C23164; Manufacturer: UNI-ROYAL(厚声); Supplier Footprint: 0603; JLCPCB Part Class: 基础库; Datasheet: https://atta.szlcsc.com/upload/public/pdf/source/20200306/C422600_1E6D84923E4A46A82E41ADD87F860B5C.pdf; Supplier: LCSC; Type: 厚膜电阻; Tolerance: ±1%; Power(Watts): 100mW; Overload Voltage (Max): 75V; Temperature Coefficient: ±400ppm/℃; Operating Temperature Range: -55℃~+155℃
R101-R104 = RC0603FR-07100RL: 电阻类型:厚膜电阻;阻值:100Ω;精度:±1%;功率:100mW;最大工作电压:75V;温度系数:±100ppm/℃;; LCSC Part Name: 厚膜电阻 100Ω ±1% 100mW; Supplier Part: C105588; Manufacturer: YAGEO(国巨); Supplier Footprint: 0603; JLCPCB Part Class: 扩展库; Datasheet: https://atta.szlcsc.com/upload/public/pdf/source/20180316/70C0E2BDAE7FCC62C531A5A58D202EE1.pdf; Supplier: LCSC; Type: 厚膜电阻; Tolerance: ±1%; Power(Watts): 100mW; Overload Voltage (Max): 75V; Temperature Coefficient: ±100ppm/℃; Operating Temperature Range: -55℃~+155℃
U1 U6 U10 U14 = CH32V203C8T6: CPU内核:RISC-V;程序存储容量:64KB;RAM总容量:20KB;GPIO端口数量:-;工作电压范围:-;CPU最大主频:144MHz;程序存储器类型:FLASH;; Supplier Part: C3001172; Manufacturer: WCH(南京沁恒); Supplier Footprint: LQFP-48(7x7); JLCPCB Part Class: 扩展库; Datasheet: https://atta.szlcsc.com/upload/public/pdf/source/20220425/D3E728E801B9982E2758AC225E3A30F9.pdf; Supplier: LCSC; CPU Core: RISC-V; Program Storage Size: 64KB; RAM Size: 20KB; CPU Maximum Speed: 144MHz; Program Memory Type: FLASH
U3 U11 = SY8205FCC: 功能类型:降压型;输入电压:-;输出电流(最大值):-;; Supplier Part: C111875; Manufacturer: silergy(矽力杰); Supplier Footprint: SOIC-8-EP; JLCPCB Part Class: 扩展库; Datasheet: https://atta.szlcsc.com/upload/public/pdf/source/20180224/C111875_15194360670851363275.pdf; Supplier: LCSC; Function: 降压型; Switch tube (built-in/external): 内置
U4 U8 U12 U16 = RT9013-33GB_C19268157: Supplier Part: C19268157; Manufacturer: TECH PUBLIC(台舟); Supplier Footprint: SOT-23-5; JLCPCB Part Class: 扩展库; Datasheet: https://atta.szlcsc.com/upload/public/pdf/source/20231201/9D78CA17020D67EC103F1AC7C29CF260.pdf; Supplier: LCSC
U5 U9 U13 U17 = FD6288Q: Supplier Part: C328453; Manufacturer: Fortior Tech(峰岹); Supplier Footprint: QFN-24-EP(4x4); JLCPCB Part Class: 扩展库; Datasheet: https://atta.szlcsc.com/upload/public/pdf/source/20181108/C328453_785547738DB9FC0123219FC22539EFAD.pdf; Supplier: LCSC
CN2 = ZX-XH2.54-4PZZ: 插针结构:1x4P;间距:2.54mm;安装方式:直插;参考系列:XH;总PIN数:4P;排数:1;每排PIN数:4;行距:-;额定电流:3A;触头材质:黄铜;触头镀层:锡;工作温度范围:-25℃~+85℃;; Supplier Part: C7429634; Manufacturer: Megastar(兆星); Supplier Footprint: 插件,P=2.54mm; JLCPCB Part Class: 扩展库; Datasheet: https://atta.szlcsc.com/upload/public/pdf/source/20230619/B529A2163E0159A644AB3383D208FB03.pdf; Supplier: LCSC; Pins Structure: 1x4P; Pitch: 2.54mm; Mounting Style: 直插; Reference Series: XH; Number of Pins: 4P; Number of Rows: 1; Number of PINs Per Row: 4; Current Rating (Max): 3A; Contact Material: 黄铜; Contact Plating: 锡; Operating Temperature Range: -25℃~+85℃
H1-H4 = PZ254V-11-02P: 插针结构:1x2P;间距:2.54mm;行距:-;圆针/方针:方针;安装类型:直插;排数:单排;总PIN位数:2P;额定电流:-;额定电压:-;配合针长度:6mm;塑高:2.5mm;端接针长度:3mm;触头材质:黄铜;触头镀层:-;工作温度范围:-40℃~+105℃;颜色:黑色;; LCSC Part Name: 间距:2.54mm 1x2P 直插 方针; Supplier Part: C492401; Manufacturer: XFCN(兴飞); Supplier Footprint: 插件,P=2.54mm; JLCPCB Part Class: 扩展库; Datasheet: https://atta.szlcsc.com/upload/public/pdf/source/20200309/C492401_A812433581A9B211A7FFA413ADDFF0E5.pdf; Supplier: LCSC; Pin Structure: 1x2P; Pitch: 2.54mm; Circluar Pins/Square Pins: 方针; Mounting Type: 直插; Number of Rows: 单排; Number of Pins: 2P; Length of Mating Pin: 6mm; Insulation Height: 2.5mm; Length of End Connection Pin: 3mm; Contact Material: 黄铜; Operating Temperature Range: -40℃~+105℃; Color: 黑色
TP1 TP2 = M3螺丝: Supplier Footprint: 插件

## Nets
3V31: C1.2 C3.2 C4.1 C27.2 L1.2 R2.2 R14.2 R15.1 U1.1(VBAT) U1.24(VDD_VIO_1) U1.36(VDD_2) U1.48(VDD_VIO_3) U4.5(VOUT)
3V32: C38.2 C39.1 C41.2 C62.2 L4.2 R26.2 R39.2 R40.1 U6.1(VBAT) U6.24(VDD_VIO_1) U6.36(VDD_2) U6.48(VDD_VIO_3) U8.5(VOUT)
5V: C19.2 C20.2 C25.2 C26.2 C61.2 D1.1(A) D5.1(A) L3.1 R18.2 U4.1(VIN) U4.3(CE) U8.1(VIN) U8.3(CE)
12V: C23.2 C24.2 C36.2 C66.2 D2.1(A) D3.1(A) D4.1(A) D6.1(A) D7.1(A) D8.1(A) F2.2 R16.2 U3.7(VIN) U3.8(VIN) U5.4(VCC) U9.4(VCC)
+3V33: C68.2 C69.1 C71.2 C92.2 L7.2 R51.2 R64.2 R65.1 U10.1(VBAT) U10.24(VDD_VIO_1) U10.36(VDD_2) U10.48(VDD_VIO_3) U12.5(VOUT)
+3V34: C98.2 C99.1 C101.2 C122.2 L10.2 R76.2 R89.2 R90.1 U14.1(VBAT) U14.24(VDD_VIO_1) U14.36(VDD_2) U14.48(VDD_VIO_3) U16.5(VOUT)
+5V: C85.2 C86.2 C90.2 C91.2 C121.2 D9.1(A) D13.1(A) L9.1 R68.2 U12.1(VIN) U12.3(CE) U16.1(VIN) U16.3(CE)
+12V: C88.2 C89.2 C96.2 C126.2 D10.1(A) D11.1(A) D12.1(A) D14.1(A) D15.1(A) D16.1(A) F4.2 R66.2 U11.7(VIN) U11.8(VIN) U13.4(VCC) U17.4(VCC)
GND: C1.1 C2.1 C3.1 C4.2 C5.1 C6.1 C7.1 C8.1 C9.1 C18.1 C19.1 C20.1 C21.1 C25.1 C26.1 C27.1 C37.1 C38.1 C39.2 C40.1 C41.1 C42.1 C43.1 C44.1 C45.1 C61.1 C62.1 C67.1 C68.1 C69.2 C70.1 C71.1 C72.1 C73.1 C74.1 C75.1 C84.1 C85.1 C86.1 C87.1 C88.1 C89.1 C90.1 C91.1 C92.1 C97.1 C98.1 C99.2 C100.1 C101.1 C102.1 C103.1 C104.1 C105.1 C121.1 C122.1 L2.1 L5.1 L8.1 L11.1 R1.2 R5.1 R8.1 R11.1 R13.1 R17.1 R19.1 R27.2 R30.1 R33.1 R36.1 R38.1 R52.2 R55.1 R58.1 R61.1 R63.1 R67.1 R69.1 R77.2 R80.1 R83.1 R86.1 R88.1 R105.1 R106.1 R107.1 U1.23(VSS_1) U1.35(VSS_2) U1.47(VSS_3) U4.2(GND) U6.23(VSS_1) U6.35(VSS_2) U6.47(VSS_3) U8.2(GND) U10.23(VSS_1) U10.35(VSS_2) U10.47(VSS_3) U12.2(GND) U14.23(VSS_1) U14.35(VSS_2) U14.47(VSS_3) U16.2(GND)
PGND: C10.1 C11.1 C12.1 C13.1 C14.1 C15.1 C16.2 C23.1 C24.1 C36.1 C66.1 C76.1 C77.1 C78.1 C79.1 C80.1 C81.1 C82.2 C96.1 C126.1 C127.1 C128.1 C129.1 C130.1 C131.1 C132.1 C133.1 C134.1 C135.1 C136.1 C137.1 C138.1 Q2.1(S) Q2.2(S) Q2.3(S) Q4.1(S) Q4.2(S) Q4.3(S) Q6.1(S) Q6.2(S) Q6.3(S) Q8.1(S) Q8.2(S) Q8.3(S) Q10.1(S) Q10.2(S) Q10.3(S) Q12.1(S) Q12.2(S) Q12.3(S) Q14.1(S) Q14.2(S) Q14.3(S) Q16.1(S) Q16.2(S) Q16.3(S) Q18.1(S) Q18.2(S) Q18.3(S) Q20.1(S) Q20.2(S) Q20.3(S) Q22.1(S) Q22.2(S) Q22.3(S) Q24.1(S) Q24.2(S) Q24.3(S) R17.2 R67.2 R105.2 R106.2 R107.2 U3.9(GND) U5.6(COM) U5.25(EP) U9.6(COM) U9.25(EP) U11.9(GND) U13.6(COM) U13.25(EP) U17.6(COM) U17.25(EP)
VCCBAT: C10.2 C11.2 C12.2 C13.2 C14.2 C15.2 C16.1 C76.2 C77.2 C78.2 C79.2 C80.2 C81.2 C82.1 C127.2 C128.2 C129.2 C130.2 C131.2 C132.2 C133.2 C134.2 C135.2 C136.2 C137.2 C138.2 F2.1 F4.1 Q1.5(D) Q1.6(D) Q1.7(D) Q1.8(D) Q1.9(D) Q3.5(D) Q3.6(D) Q3.7(D) Q3.8(D) Q3.9(D) Q5.5(D) Q5.6(D) Q5.7(D) Q5.8(D) Q5.9(D) Q7.5(D) Q7.6(D) Q7.7(D) Q7.8(D) Q7.9(D) Q9.5(D) Q9.6(D) Q9.7(D) Q9.8(D) Q9.9(D) Q11.5(D) Q11.6(D) Q11.7(D) Q11.8(D) Q11.9(D) Q13.5(D) Q13.6(D) Q13.7(D) Q13.8(D) Q13.9(D) Q15.5(D) Q15.6(D) Q15.7(D) Q15.8(D) Q15.9(D) Q17.5(D) Q17.6(D) Q17.7(D) Q17.8(D) Q17.9(D) Q19.5(D) Q19.6(D) Q19.7(D) Q19.8(D) Q19.9(D) Q21.5(D) Q21.6(D) Q21.7(D) Q21.8(D) Q21.9(D) Q23.5(D) Q23.6(D) Q23.7(D) Q23.8(D) Q23.9(D) R12.1 R37.1 R62.1 R87.1
ABMF1: C6.2 R3.1 R4.1 R5.2 U1.22(PB11)
ABMF2: C42.2 R28.1 R29.1 R30.2 U6.22(PB11)
ABMF3: C72.2 R53.1 R54.1 R55.2 U10.22(PB11)
ABMF4: C102.2 R78.1 R79.1 R80.2 U14.22(PB11)
BATADC1: C9.2 R12.2 R13.2 U1.11(PA1/ADC1)
BATADC2: C45.2 R37.2 R38.2 U6.11(PA1/ADC1)
BATADC3: C75.2 R62.2 R63.2 U10.11(PA1/ADC1)
BATADC4: C105.2 R87.2 R88.2 U14.11(PA1/ADC1)
BBMF1: C7.2 R6.1 R7.1 R8.2 U1.21(PB10)
BBMF2: C43.2 R31.1 R32.1 R33.2 U6.21(PB10)
BBMF3: C73.2 R56.1 R57.1 R58.2 U10.21(PB10)
BBMF4: C103.2 R81.1 R82.1 R83.2 U14.21(PB10)
CBMF1: C8.2 R9.1 R10.1 R11.2 U1.15(PA5/ADC5/DAC1)
CBMF2: C44.2 R34.1 R35.1 R36.2 U6.15(PA5/ADC5/DAC1)
CBMF3: C74.2 R59.1 R60.1 R61.2 U10.15(PA5/ADC5/DAC1)
CBMF4: C104.2 R84.1 R85.1 R86.2 U14.15(PA5/ADC5/DAC1)
CLK1: U1.37(PA14/SWCLK)
CLK2: U6.37(PA14/SWCLK)
CLK3: U10.37(PA14/SWCLK)
CLK4: U14.37(PA14/SWCLK)
CMPO1: U1.12(PA2/ADC2) U1.13(PA3/ADC3) U1.14(PA4/ADC4/DAC0)
CMPO2: U6.12(PA2/ADC2) U6.13(PA3/ADC3) U6.14(PA4/ADC4/DAC0)
CMPO3: U10.12(PA2/ADC2) U10.13(PA3/ADC3) U10.14(PA4/ADC4/DAC0)
CMPO4: U14.12(PA2/ADC2) U14.13(PA3/ADC3) U14.14(PA4/ADC4/DAC0)
DIO1: U1.34(PA13/SWDIO)
DIO2: U6.34(PA13/SWDIO)
DIO3: U10.34(PA13/SWDIO)
DIO4: U14.34(PA13/SWDIO)
ERR1: LED1.1(K) U1.45(PB8)
ERR2: LED3.1(K) U6.45(PB8)
ERR3: LED5.1(K) U10.45(PB8)
ERR4: LED7.1(K) U14.45(PB8)
FB1: R18.1 R19.2 U3.5(FB)
FB2: R68.1 R69.2 U11.5(FB)
HOA1: R20.2 U5.19(HO1)
HOA2: R45.2 U9.19(HO1)
HOA3: R70.2 U13.19(HO1)
HOA4: R95.2 U17.19(HO1)
HOB1: R22.2 U5.16(HO2)
HOB2: R47.2 U9.16(HO2)
HOB3: R72.2 U13.16(HO2)
HOB4: R97.2 U17.16(HO2)
HOC1: R24.2 U5.13(HO3)
HOC2: R49.2 U9.13(HO3)
HOC3: R74.2 U13.13(HO3)
HOC4: R99.2 U17.13(HO3)
LOA1: R21.2 U5.11(LO1)
LOA2: R46.2 U9.11(LO1)
LOA3: R71.2 U13.11(LO1)
LOA4: R96.2 U17.11(LO1)
LOB1: R23.2 U5.10(LO2)
LOB2: R48.2 U9.10(LO2)
LOB3: R73.2 U13.10(LO2)
LOB4: R98.2 U17.10(LO2)
LOC1: R25.2 U5.9(LO3)
LOC2: R50.2 U9.9(LO3)
LOC3: R75.2 U13.9(LO3)
LOC4: R100.2 U17.9(LO3)
MID1: R4.2 R7.2 R10.2 U1.27(PB14) U1.28(PB15)
MID2: R29.2 R32.2 R35.2 U6.27(PB14) U6.28(PB15)
MID3: R54.2 R57.2 R60.2 U10.27(PB14) U10.28(PB15)
MID4: R79.2 R82.2 R85.2 U14.27(PB14) U14.28(PB15)
NRST1: C5.2 R2.1 U1.7(NRST)
NRST2: C40.2 R26.1 U6.7(NRST)
NRST3: C70.2 R51.1 U10.7(NRST)
NRST4: C100.2 R76.1 U14.7(NRST)
P1: CN2.1 R101.2
P2: CN2.2 R102.2
P3: CN2.3 R103.2
P4: CN2.4 R104.2
PWMAH1: U1.29(PA8) U5.22(HIN1)
PWMAH2: U6.29(PA8) U9.22(HIN1)
PWMAH3: U10.29(PA8) U13.22(HIN1)
PWMAH4: U14.29(PA8) U17.22(HIN1)
PWMAL1: U1.17(PA7/ADC7) U5.1(LIN1)
PWMAL2: U6.17(PA7/ADC7) U9.1(LIN1)
PWMAL3: U10.17(PA7/ADC7) U13.1(LIN1)
PWMAL4: U14.17(PA7/ADC7) U17.1(LIN1)
PWMBH1: U1.30(PA9) U5.23(HIN2)
PWMBH2: U6.30(PA9) U9.23(HIN2)
PWMBH3: U10.30(PA9) U13.23(HIN2)
PWMBH4: U14.30(PA9) U17.23(HIN2)
PWMBL1: U1.18(PB0/ADC8) U5.2(LIN2)
PWMBL2: U6.18(PB0/ADC8) U9.2(LIN2)
PWMBL3: U10.18(PB0/ADC8) U13.2(LIN2)
PWMBL4: U14.18(PB0/ADC8) U17.2(LIN2)
PWMCH1: U1.31(PA10) U5.24(HIN3)
PWMCH2: U6.31(PA10) U9.24(HIN3)
PWMCH3: U10.31(PA10) U13.24(HIN3)
PWMCH4: U14.31(PA10) U17.24(HIN3)
PWMCL1: U1.19(PB1/ADC9) U5.3(LIN3)
PWMCL2: U6.19(PB1/ADC9) U9.3(LIN3)
PWMCL3: U10.19(PB1/ADC9) U13.3(LIN3)
PWMCL4: U14.19(PB1/ADC9) U17.3(LIN3)
PWMIN1: R101.1 U1.38(PA15)
PWMIN2: R102.1 U6.38(PA15)
PWMIN3: R103.1 U10.38(PA15)
PWMIN4: R104.1 U14.38(PA15)
RUN1: LED2.1(K) U1.46(PB9)
RUN2: LED4.1(K) U6.46(PB9)
RUN3: LED6.1(K) U10.46(PB9)
RUN4: LED8.1(K) U14.46(PB9)
RX1: H1.1 U1.43(PB7)
RX2: H2.1 U6.43(PB7)
RX3: H3.1 U10.43(PB7)
RX4: H4.1 U14.43(PB7)
TX1: H1.2 U1.42(PB6)
TX2: H2.2 U6.42(PB6)
TX3: H3.2 U10.42(PB6)
TX4: H4.2 U14.42(PB6)
VSA1: C33.1 Q1.1(S) Q1.2(S) Q1.3(S) Q2.5(D) Q2.6(D) Q2.7(D) Q2.8(D) Q2.9(D) R3.2 U5.18(VS1)
VSA2: C63.1 Q7.1(S) Q7.2(S) Q7.3(S) Q8.5(D) Q8.6(D) Q8.7(D) Q8.8(D) Q8.9(D) R28.2 U9.18(VS1)
VSA3: C93.1 Q13.1(S) Q13.2(S) Q13.3(S) Q14.5(D) Q14.6(D) Q14.7(D) Q14.8(D) Q14.9(D) R53.2 U13.18(VS1)
VSA4: C123.1 Q19.1(S) Q19.2(S) Q19.3(S) Q20.5(D) Q20.6(D) Q20.7(D) Q20.8(D) Q20.9(D) R78.2 U17.18(VS1)
VSB1: C34.1 Q3.1(S) Q3.2(S) Q3.3(S) Q4.5(D) Q4.6(D) Q4.7(D) Q4.8(D) Q4.9(D) R6.2 U5.15(VS2)
VSB2: C64.1 Q9.1(S) Q9.2(S) Q9.3(S) Q10.5(D) Q10.6(D) Q10.7(D) Q10.8(D) Q10.9(D) R31.2 U9.15(VS2)
VSB3: C94.1 Q15.1(S) Q15.2(S) Q15.3(S) Q16.5(D) Q16.6(D) Q16.7(D) Q16.8(D) Q16.9(D) R56.2 U13.15(VS2)
VSB4: C124.1 Q21.1(S) Q21.2(S) Q21.3(S) Q22.5(D) Q22.6(D) Q22.7(D) Q22.8(D) Q22.9(D) R81.2 U17.15(VS2)
VSC1: C35.1 Q5.1(S) Q5.2(S) Q5.3(S) Q6.5(D) Q6.6(D) Q6.7(D) Q6.8(D) Q6.9(D) R9.2 U5.12(VS3)
VSC2: C65.1 Q11.1(S) Q11.2(S) Q11.3(S) Q12.5(D) Q12.6(D) Q12.7(D) Q12.8(D) Q12.9(D) R34.2 U9.12(VS3)
VSC3: C95.1 Q17.1(S) Q17.2(S) Q17.3(S) Q18.5(D) Q18.6(D) Q18.7(D) Q18.8(D) Q18.9(D) R59.2 U13.12(VS3)
VSC4: C125.1 Q23.1(S) Q23.2(S) Q23.3(S) Q24.5(D) Q24.6(D) Q24.7(D) Q24.8(D) Q24.9(D) R84.2 U17.12(VS3)
$1N5530: R1.1 U1.44(BOOT0)
$1N5540: L2.2 U1.8(VSSA)
$1N5873: C2.2 L1.1 U1.9(VDDA)
$1N7449: LED1.2(A) R14.1
$1N7452: LED2.2(A) R15.2
$1N8563: C17.1 L3.2 U3.2(LX)
$1N8564: C18.2 U3.4(SS)
$1N8570: C17.2 U3.1(BS)
$1N8571: R16.1 U3.3(EN)
$1N8573: C21.2 U3.6(VCC)
$1N9490: C34.2 D2.2(K) U5.17(VB2)
$1N9491: C33.2 D4.2(K) U5.20(VB1)
$1N9495: C35.2 D3.2(K) U5.14(VB3)
$1N11984: Q2.4(G) R21.1
$1N11985: Q1.4(G) R20.1
$1N11994: Q4.4(G) R23.1
$1N11995: Q3.4(G) R22.1
$1N12004: Q6.4(G) R25.1
$1N12005: Q5.4(G) R24.1
$2N3726: R27.1 U6.44(BOOT0)
$2N3736: L5.2 U6.8(VSSA)
$2N3779: C37.2 L4.1 U6.9(VDDA)
$2N3810: LED3.2(A) R39.1
$2N3811: LED4.2(A) R40.2
$2N3867: C64.2 D7.2(K) U9.17(VB2)
$2N3868: C63.2 D6.2(K) U9.20(VB1)
$2N3872: C65.2 D8.2(K) U9.14(VB3)
$2N3879: Q8.4(G) R46.1
$2N3880: Q7.4(G) R45.1
$2N3888: Q10.4(G) R48.1
$2N3889: Q9.4(G) R47.1
$2N3897: Q12.4(G) R50.1
$2N3898: Q11.4(G) R49.1
$3N7620: R52.1 U10.44(BOOT0)
$3N7630: L8.2 U10.8(VSSA)
$3N7673: C67.2 L7.1 U10.9(VDDA)
$3N7704: LED5.2(A) R64.1
$3N7705: LED6.2(A) R65.2
$3N7713: C83.1 L9.2 U11.2(LX)
$3N7714: C84.2 U11.4(SS)
$3N7720: C83.2 U11.1(BS)
$3N7721: R66.1 U11.3(EN)
$3N7723: C87.2 U11.6(VCC)
$3N7761: C94.2 D11.2(K) U13.17(VB2)
$3N7762: C93.2 D10.2(K) U13.20(VB1)
$3N7766: C95.2 D12.2(K) U13.14(VB3)
$3N7773: Q14.4(G) R71.1
$3N7774: Q13.4(G) R70.1
$3N7782: Q16.4(G) R73.1
$3N7783: Q15.4(G) R72.1
$3N7791: Q18.4(G) R75.1
$3N7792: Q17.4(G) R74.1
$4N7620: R77.1 U14.44(BOOT0)
$4N7630: L11.2 U14.8(VSSA)
$4N7673: C97.2 L10.1 U14.9(VDDA)
$4N7704: LED7.2(A) R89.1
$4N7705: LED8.2(A) R90.2
$4N7761: C124.2 D15.2(K) U17.17(VB2)
$4N7762: C123.2 D14.2(K) U17.20(VB1)
$4N7766: C125.2 D16.2(K) U17.14(VB3)
$4N7773: Q20.4(G) R96.1
$4N7774: Q19.4(G) R95.1
$4N7782: Q22.4(G) R98.1
$4N7783: Q21.4(G) R97.1
$4N7791: Q24.4(G) R100.1
$4N7792: Q23.4(G) R99.1

Not connected (* = marked no-connect by the designer): D1 2(K); D5 2(K); D9 2(K); D13 2(K); TP1 1*; TP2 1*; U1 2(PC13/TAMPER_RTC)* 3(PC14/OSC32IN)* 4(PC15/OSC32OUT)* 5(OSC_IN/PD0)* 6(OSC_OUT/PD1)* 10(PA0/WKUP/ADC0)* 16(PA6/ADC6)* 20(PB2/BOOT1)* 25(PB12)* 26(PB13)* 32(PA11/USB1DM)* 33(PA12/USB1DP)* 39(PB3)* 40(PB4)* 41(PB5)*; U4 4(NC)*; U5 5(NC)* 7(NC)* 8(NC)* 21(NC)*; U6 2(PC13/TAMPER_RTC)* 3(PC14/OSC32IN)* 4(PC15/OSC32OUT)* 5(OSC_IN/PD0)* 6(OSC_OUT/PD1)* 10(PA0/WKUP/ADC0)* 16(PA6/ADC6)* 20(PB2/BOOT1)* 25(PB12)* 26(PB13)* 32(PA11/USB1DM)* 33(PA12/USB1DP)* 39(PB3)* 40(PB4)* 41(PB5)*; U8 4(NC)*; U9 5(NC)* 7(NC)* 8(NC)* 21(NC)*; U10 2(PC13/TAMPER_RTC)* 3(PC14/OSC32IN)* 4(PC15/OSC32OUT)* 5(OSC_IN/PD0)* 6(OSC_OUT/PD1)* 10(PA0/WKUP/ADC0)* 16(PA6/ADC6)* 20(PB2/BOOT1)* 25(PB12)* 26(PB13)* 32(PA11/USB1DM)* 33(PA12/USB1DP)* 39(PB3)* 40(PB4)* 41(PB5)*; U12 4(NC)*; U13 5(NC)* 7(NC)* 8(NC)* 21(NC)*; U14 2(PC13/TAMPER_RTC)* 3(PC14/OSC32IN)* 4(PC15/OSC32OUT)* 5(OSC_IN/PD0)* 6(OSC_OUT/PD1)* 10(PA0/WKUP/ADC0)* 16(PA6/ADC6)* 20(PB2/BOOT1)* 25(PB12)* 26(PB13)* 32(PA11/USB1DM)* 33(PA12/USB1DP)* 39(PB3)* 40(PB4)* 41(PB5)*; U16 4(NC)*; U17 5(NC)* 7(NC)* 8(NC)* 21(NC)*

## Notes on the sheets
sheet 1
- MCU
- 换相检测
- 5V电源
- 不焊
- 不焊
- 不焊
- 三相桥
- 信号输入
- 指示灯
- 预驱
- 4in1电调
  驱动1口
- 3.3V电源
- 电压测量
- 电源接口
sheet 2
- MCU
- 换相检测
- 不焊
- 不焊
- 不焊
- 三相桥
- 信号输入
- 指示灯
- 预驱
- 4in1电调
  驱动2口
- 3.3V电源
- 电压测量
sheet 3
- MCU
- 换相检测
- 5V电源
- 不焊
- 不焊
- 不焊
- 三相桥
- 信号输入
- 指示灯
- 预驱
- 4in1电调
  驱动3口
- 3.3V电源
- 电压测量
- 电源接口
sheet 4
- MCU
- 换相检测
- 不焊
- 不焊
- 不焊
- 三相桥
- 信号输入
- 指示灯
- 预驱
- 4in1电调
  驱动4口
- 3.3V电源
- 电压测量
